# EasyEDA Pro project FrameworkGPU to MXM V0.3.epro, board PCB6
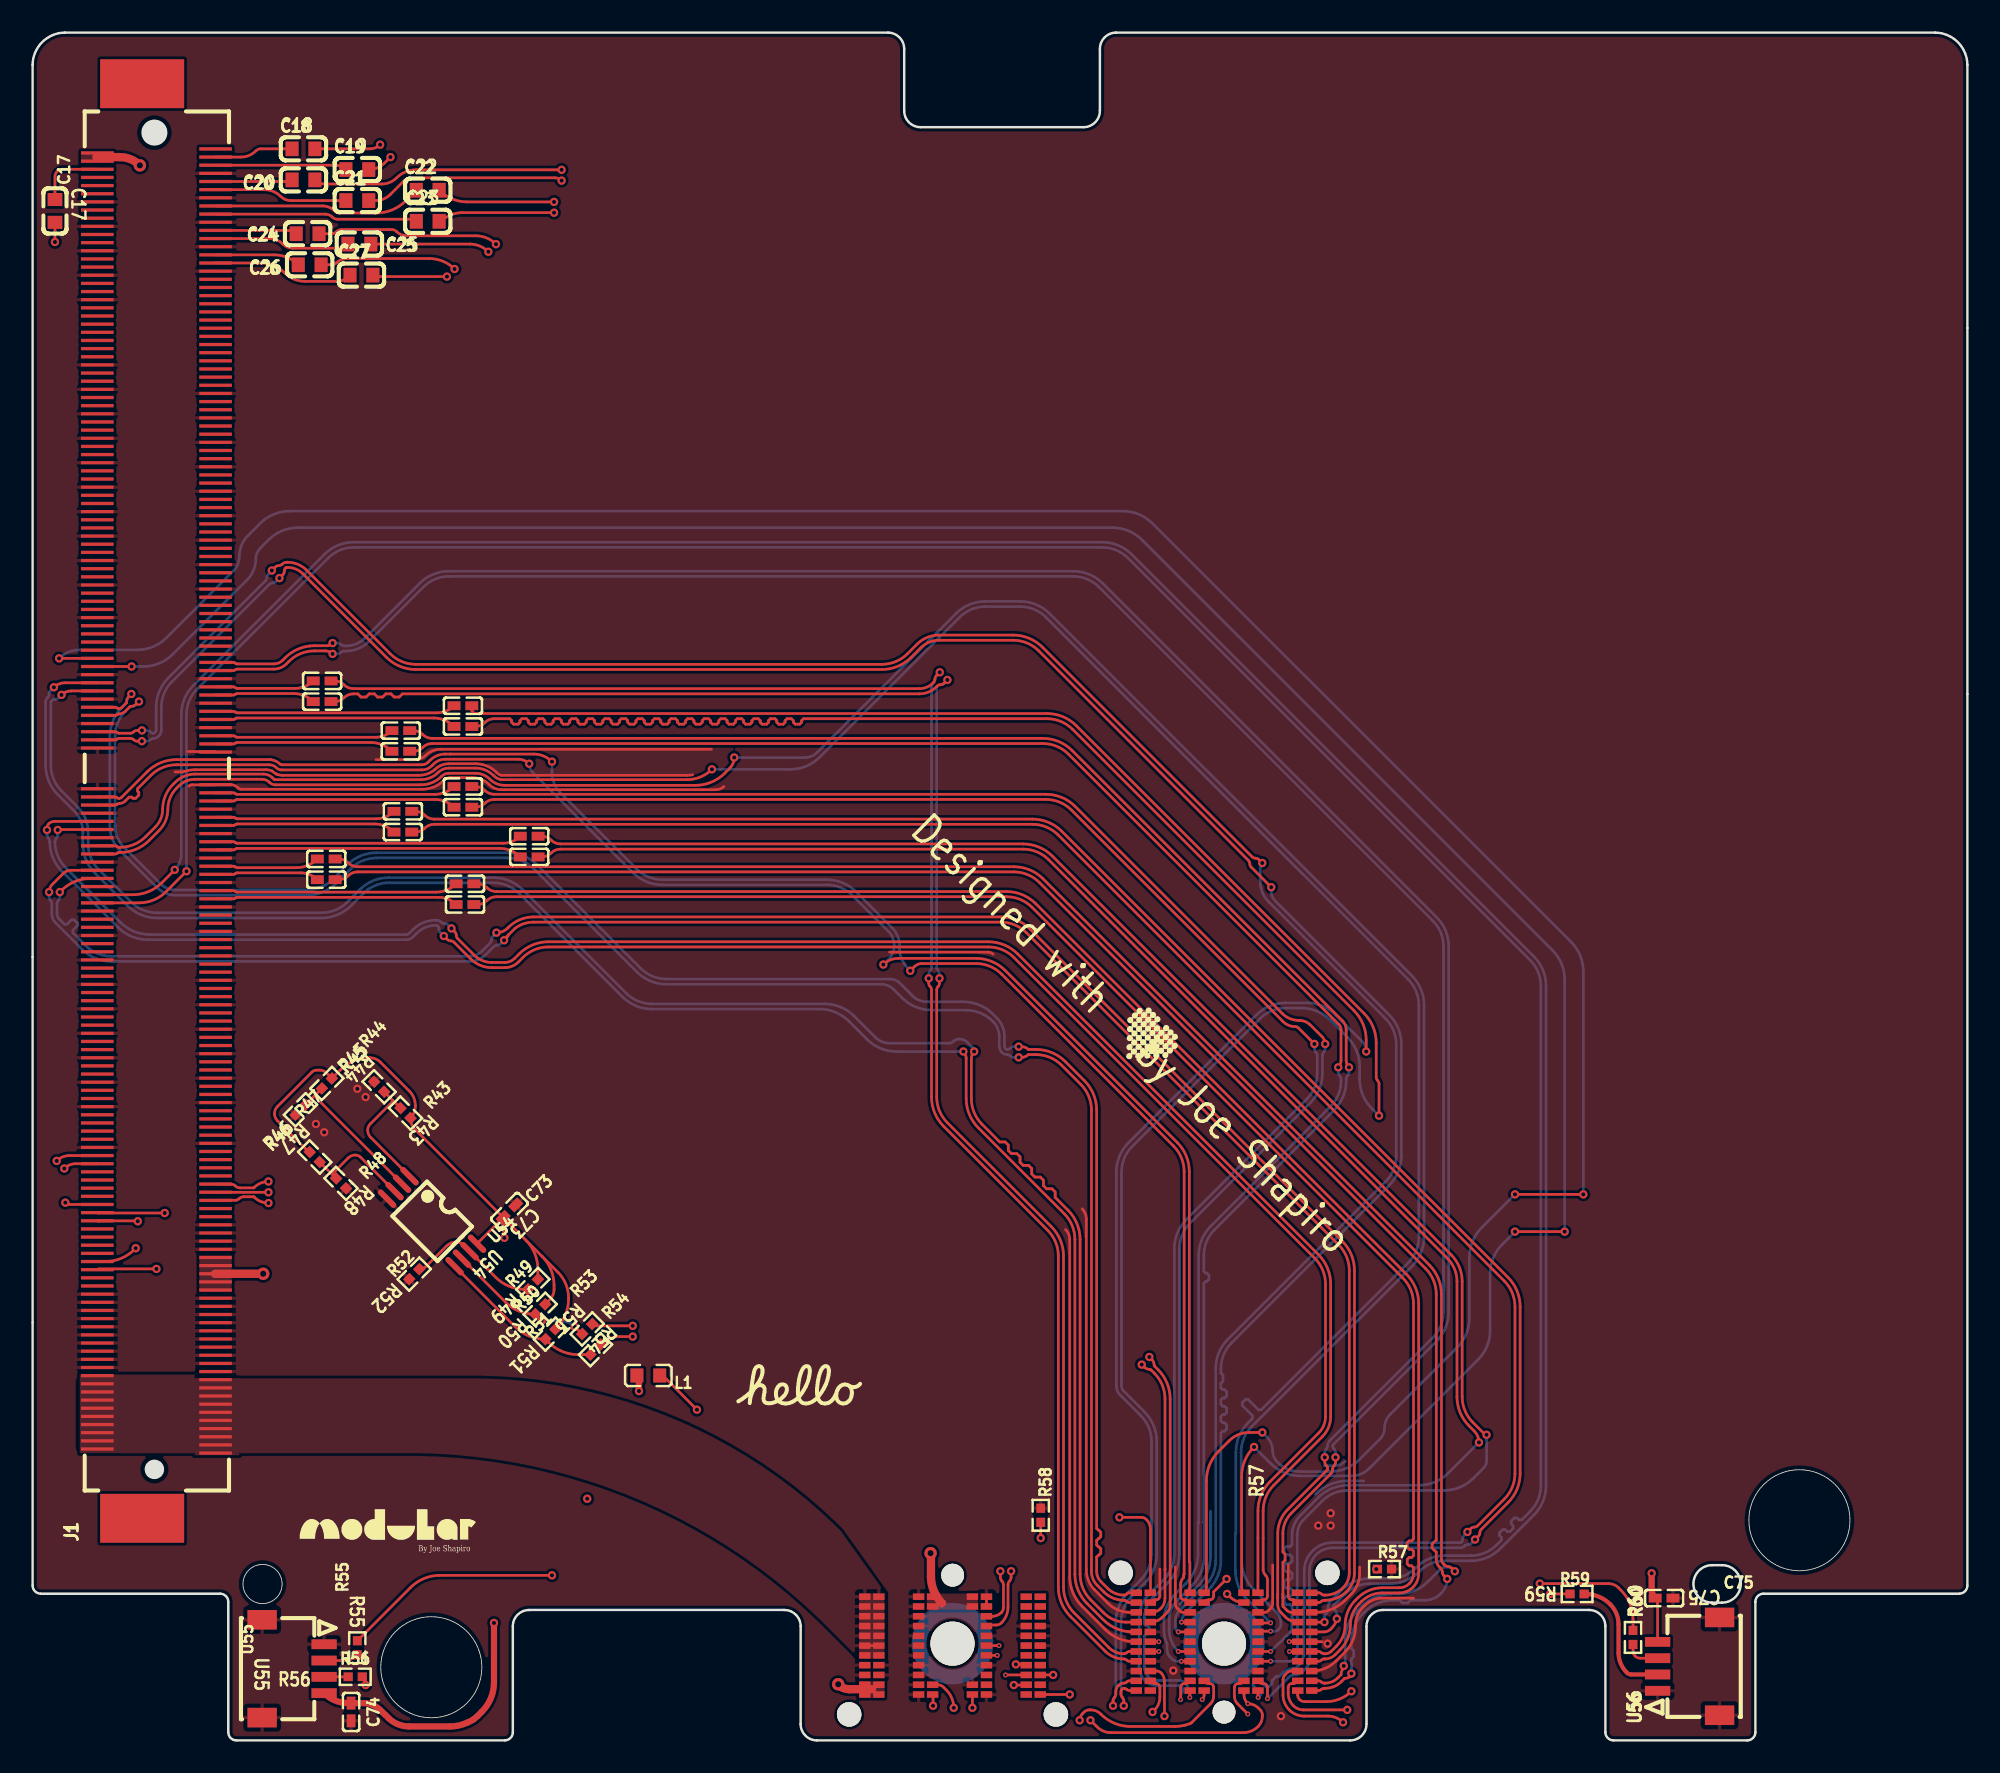
[diagram p5: board, top side]
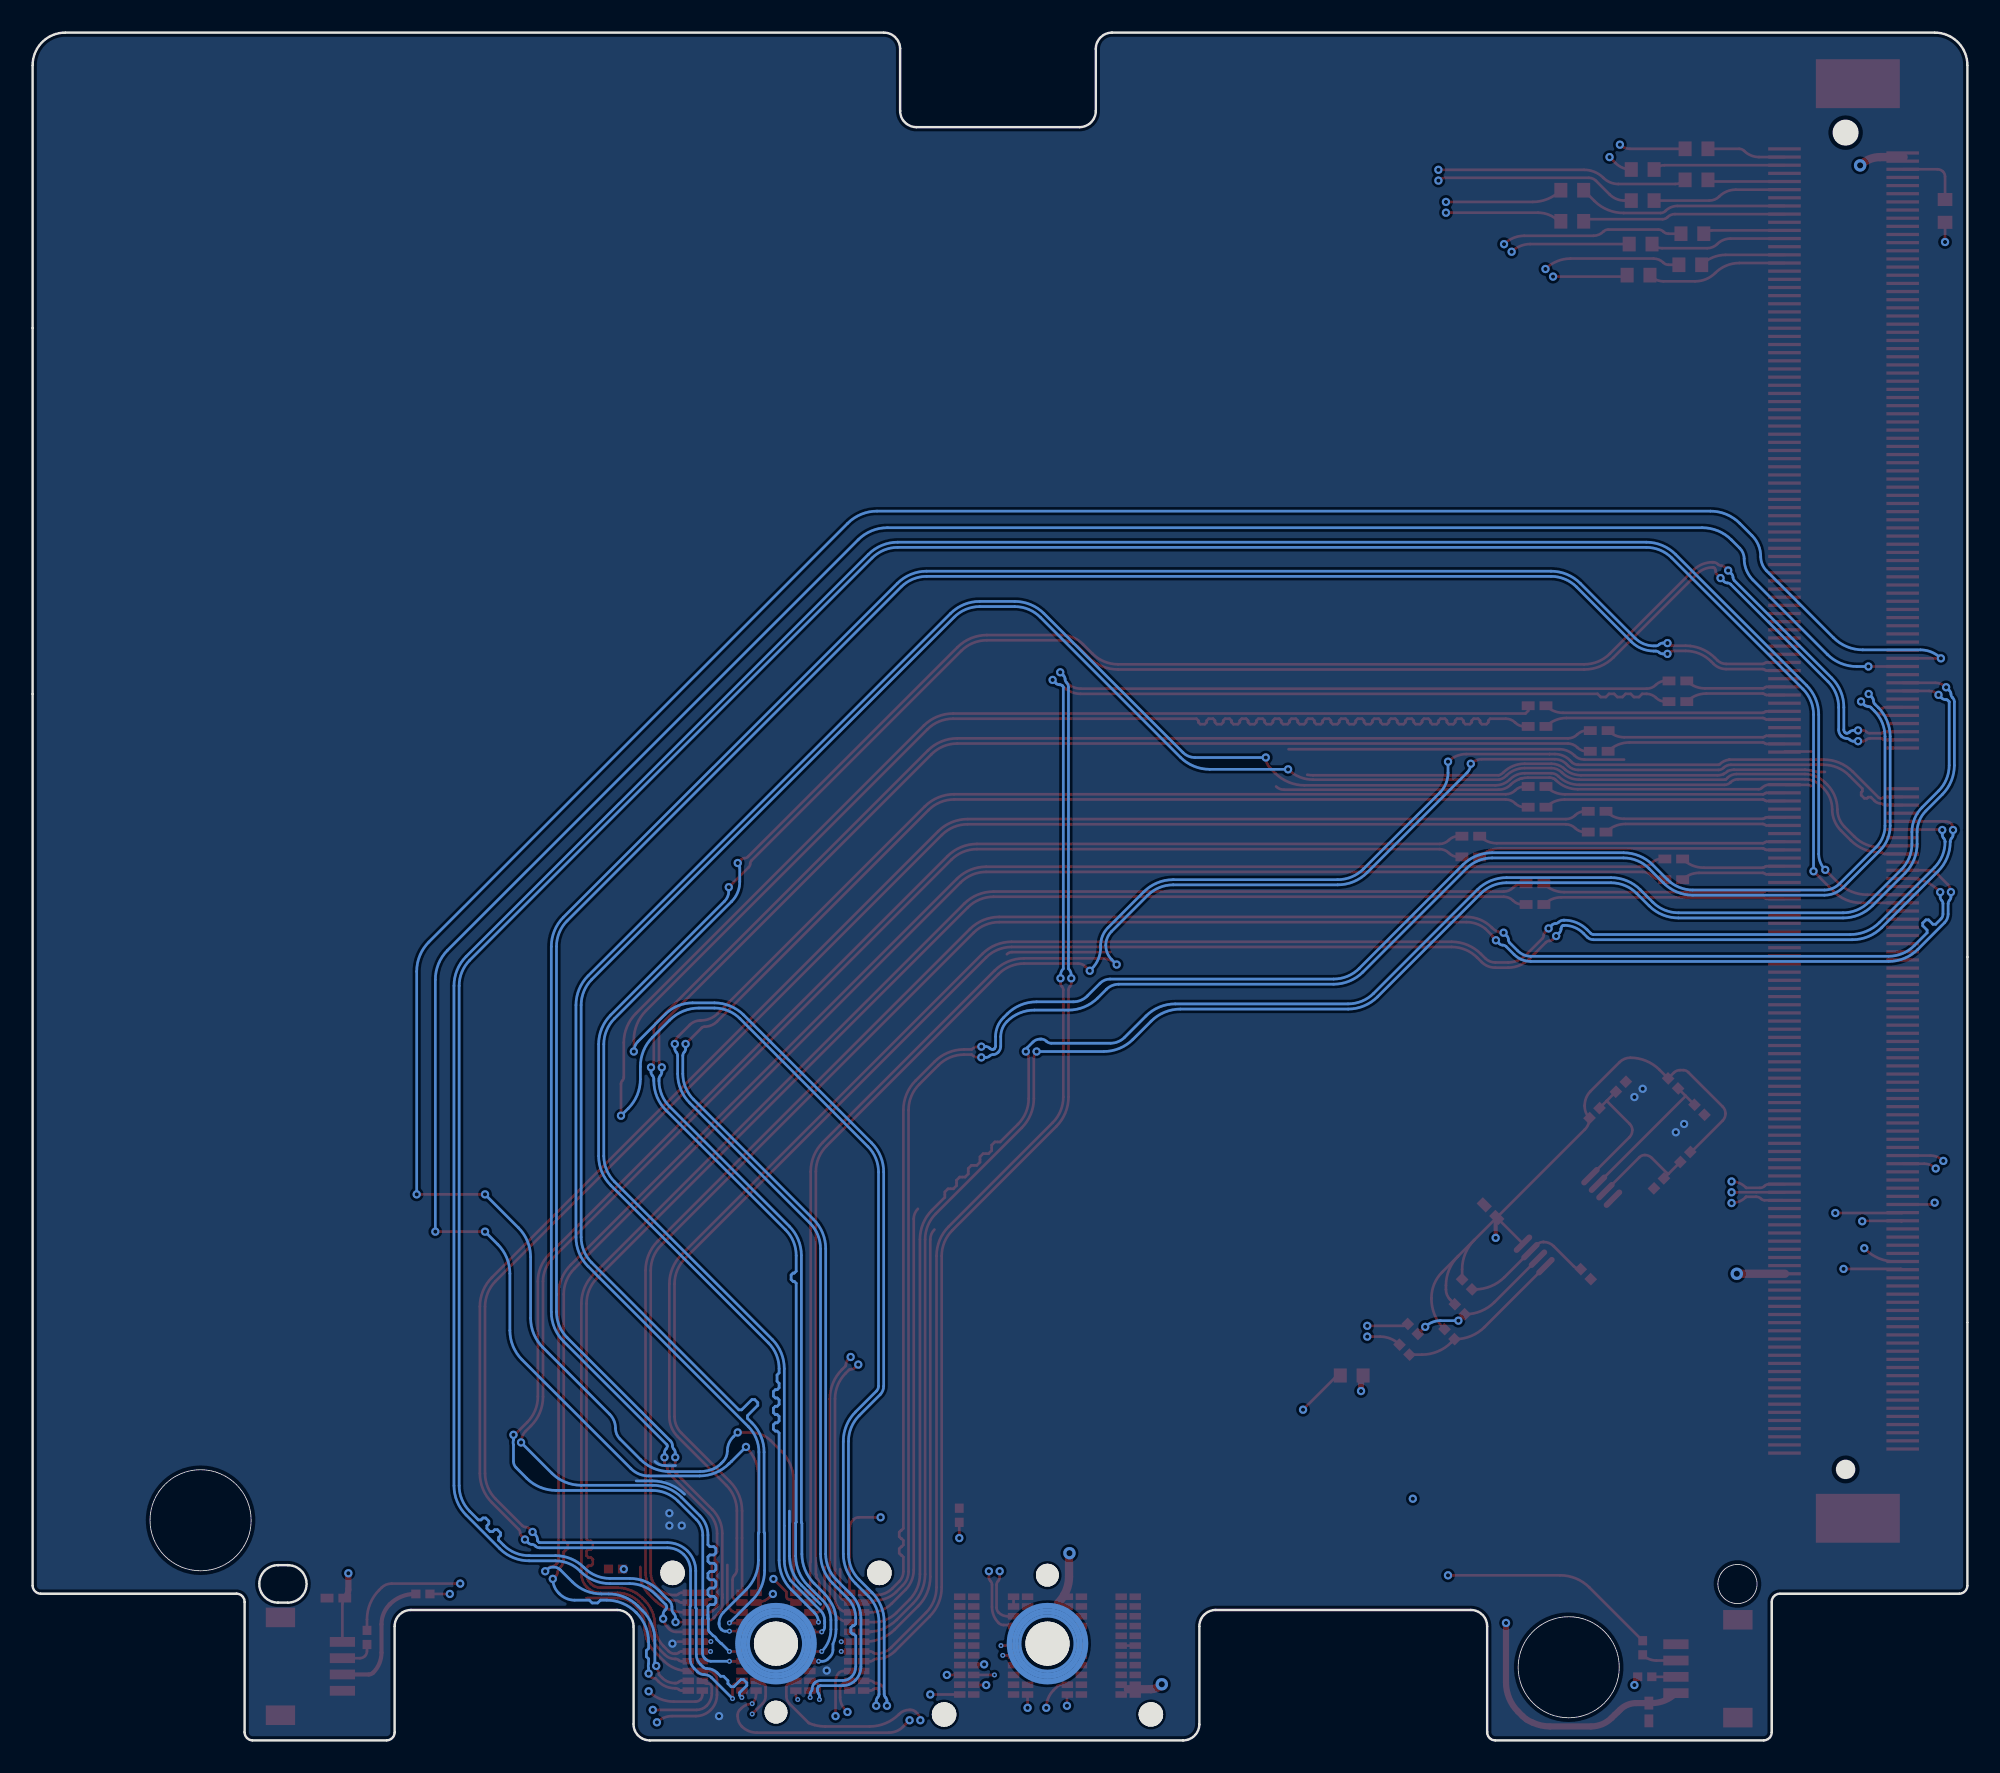
[diagram p6: board, bottom side, seen from below]

Outline 118.65 x 104.76 mm; copper layers: Top Layer, Inner2, Inner3, Bottom Layer. Coordinates in mm from the lower left corner of the outline.
Outline path: circle c14.1,9.59 r1.2 ; circle c24.45,4.49 r3.1 ; circle c108.35,13.5 r3.1 ; 0,102.76 arc(0.59,104.17) 2,104.76 52.45,104.76 arc(53.16,104.47) 53.45,103.76 53.45,99.96 arc(53.74,99.25) 54.45,98.96 64.45,98.96 arc(65.16,99.25) 65.45,99.96 65.45,103.76 arc(65.74,104.47) 66.45,104.76 116.65,104.76 arc(118.06,104.17) 118.65,102.76 118.65,9.5 arc(118.5,9.15) 118.15,9 106.15,9 arc(105.8,8.85) 105.65,8.5 105.65,0.5 arc(105.5,0.15) 105.15,0 96.95,0 arc(96.6,0.15) 96.45,0.5 96.45,7 arc(96.16,7.71) 95.45,8 82.8,8 arc(82.09,7.71) 81.8,7 81.8,1 arc(81.51,0.29) 80.8,0 48.1,0 arc(47.39,0.29) 47.1,1 47.1,7 arc(46.81,7.71) 46.1,8 30.45,8 arc(29.74,7.71) 29.45,7 29.45,0.5 arc(29.3,0.15) 28.95,0 12.5,0 arc(12.15,0.15) 12,0.5 12,8.5 arc(11.85,8.85) 11.5,9 0.5,9 arc(0.15,9.15) 0,9.5 0,102.76 ; 103,8.45 arc(101.85,9.6) 103,10.75 103.6,10.75 arc(104.75,9.6) 103.6,8.45 103,8.45
Stack: Top Layer 0.035mm / Dielectric1 1.51mm FR4 er 4.5 / Inner2 0.035mm / Dielectric2 0.48mm PP er 4.5 / Inner3 0.035mm / Dielectric3 0.48mm PP er 4.5 / Bottom Layer 0.035mm

## Design rules (mm)
net PCIE_RX_7N: PCIE_RX_7
net PCIE_RX_1P: PCIE_RX_1, PCIE_RX_1
net PCIE_RX_1N: PCIE_RX_1, PCIE_RX_1
net PCIE_RX_7P: PCIE_RX_7
net PCIE_RX_6N: DP1
net PCIE_RX_3N: PCIE_RX_3
net PCIE_RX_0N: PCIE_RX_0
net PCIE_RX_0P: PCIE_RX_0
net PCIE_RX_4N: PCIE_RX_4
net PCIE_RX_6P: DP1
net PCIE_RX_5N: PCIE_RX_5
net PCIE_RX_5P: PCIE_RX_5
net PCIE_RX_2P: PCIE_RX_2
net PCIE_RX_4P: PCIE_RX_4
net PCIE_RX_3P: PCIE_RX_3
net PCIE_RX_2N: PCIE_RX_2
net $1N3802: DP9
net $1N3808: DP9
net $1N4102: DP5
net $1N3928: DP8
net $1N4162: DP3
net $1N4168: DP3
net $1N4222: DP4
net PEX_REFCLK-: DP11
net DP_A_AUXN: DP_A_AUX
net $1N3868: PCIE_TX_1, DP10
net $1N3862: PCIE_TX_1, DP10
net $1N4228: DP4
net PEX_REFCLK+: DP11
net DP_A_AUXP: DP_A_AUX
net $1N3988: DP7
net DP_A_L0N: DP_A_L0
net $1N3982: DP7
net $1N3922: DP8
net DP_A_L1N: DP_A_L1
net DP_A_L3N: DP_A_L3
net DP_A_L0P: DP_A_L0
net DP_A_L2N: DP_A_L2
net DP_A_L2P: DP_A_L2
net DP_A_L1P: DP_A_L1
net DP_A_L3P: DP_A_L3
net $1N4108: DP5
net $1N4042: DP6
net $1N4048: DP6
net $1N13436: DP13
net $1N13662: DP15
net $1N13602: DP14
net $1N13548: DP13
net $1N13722: DP15
net $1N13668: DP14
net $1N13542: DP12
net $1N13608: DP12
net PCIE_TX_7P: DP2
net PCIE_TX_6P: PCIE_TX_6
net PCIE_TX_7N: DP2
net PCIE_TX_6N: PCIE_TX_6
net PCIE_TX_4P: PCIE_TX_4
net PCIE_TX_4N: PCIE_TX_4
net PCIE_TX_3P: PCIE_TX_3
net PCIE_TX_5N: PCIE_TX_5
net PCIE_TX_2N: PCIE_TX_2
net PCIE_TX_0P: PCIE_TX_0
net PCIE_TX_5P: PCIE_TX_5
net PCIE_TX_2P: PCIE_TX_2
net PCIE_TX_0N: PCIE_TX_0
net PCIE_TX_1N: PCIE_TX_1, PCIE_TX_1
net PCIE_TX_1P: PCIE_TX_1, PCIE_TX_1
net PCIE_TX_3N: PCIE_TX_3
template: Custom Config
spacing copperThickness1oz (default): track to track 0.102, other pairs 0.152 to 0.3
spacing copperThickness2oz: track to track 0.203, other pairs 0.152 to 0.3
track width copperThickness1oz (default): min 0.127, default 0.165, max 2.54
track width copperThickness2oz: min 0.203, default 0.254, max 2.54
differential pair differentialPair (default): width min 0.127, default 0.165, max 2.54; gap min 0.152, default 0.152
via viaSize (default): diameter min 0.251, default 0.508, max 10; hole min 0.15, default 0.254, max 6.3

## Placement (name value [footprint] x y rotation side)
C1  220nF  [C0402]  17.75 64.99 0 top
C2  220nF  [C0402]  17.75 63.72 0 top
C3  220nF  [C0402]  26.39 63.47 0 top
C4  220nF  [C0402]  26.39 62.2 0 top
C5  220nF  [C0402]  22.58 61.94 0 top
C6  220nF  [C0402]  22.58 60.67 0 top
C7  220nF  [C0402]  26.39 58.51 0 top
C8  220nF  [C0402]  26.39 57.24 0 top
C9  220nF  [C0402]  22.71 56.99 0 top
C10  220nF  [C0402]  22.71 55.72 0 top
C11  220nF  [C0402]  30.45 55.47 0 top
C12  220nF  [C0402]  30.45 54.2 0 top
C13  220nF  [C0402]  18.01 54.07 0 top
C14  220nF  [C0402]  18.01 52.8 0 top
C15  220nF  [C0402]  26.52 52.54 0 top
C16  220nF  [C0402]  26.52 51.27 0 top
C17  100nF  [C0603]  1.37 93.82 270 top
C18  100nF  [C0603]  16.61 97.63 0 top
C19  100nF  [C0603]  19.91 96.36 0 top
C20  100nF  [C0603]  16.61 95.72 0 top
C21  100nF  [C0603]  19.91 94.45 0 top
C22  100nF  [C0603]  24.23 95.09 0 top
C23  100nF  [C0603]  24.23 93.18 0 top
C24  100nF  [C0603]  16.86 92.42 0 top
C25  100nF  [C0603]  20.04 91.79 0 top
C26  100nF  [C0603]  16.99 90.52 0 top
C27  100nF  [C0603]  20.17 89.88 0 top
C73  0.1uF  [C0402#2]  29.24 32.46 225 top
C74  10uF  [C0402#2]  19.53 1.74 270 top
C75  10uF  [C0402#2]  100.05 8.73 0 top
J1  MXM3.0  [CONN-SMD_314P-P0.50_10151114-001TLF]  7.59 57.62 90 top
L1  100M  [L0603]  37.76 22.38 180 top
R43  0/NC  [R0402]  22.87 38.48 315 top
R44  0  [R0402]  21.25 40.1 315 top
R45  0/NC  [R0402]  18.05 40.3 45 top
R46  0  [R0402]  16.43 38.68 45 top
R47  0/NC  [R0402]  17.3 35.79 135 top
R48  0  [R0402]  18.91 34.17 135 top
R49  100K ±1%  [R0402]  30.68 27.97 45 top
R50  4.7K ±1%  [R0402]  31.13 26.45 45 top
R51  4.7K ±1%  [R0402]  31.76 24.92 45 top
R52  100K ±1%  [R0402]  23.41 28.6 45 top
R53  0  [R0402]  34.01 25.24 225 top
R54  0  [R0402]  34.52 23.97 225 top
R55  0  [R0402]  19.91 5.68 90 top
R56  0  [R0402]  19.79 3.9 0 top
R57  330k ±1%  [R0402]  82.9 10.51 180 top
R58  330k ±1%  [R0402]  61.82 13.81 270 top
R59  0  [R0402]  94.72 8.98 180 top
R60  0  [R0402]  98.14 6.32 90 top
U2  FXBeam  [FW_FXBEAM_FULL]  64.74 5.94 0 top
U54  BR24G32FVT-3GE2  [TSSOP-8_L4.4-W3.0-P0.65-LS6.4-BL]  24.49 31.85 225 top
U55  A1001WR-S-04P  [CONN-SMD_A1001WR-S-04P]  15.98 4.4 270 top
U56  A1001WR-S-04P  [CONN-SMD_A1001WR-S-04P]  101.55 4.54 90 top

## Footprints (pads in the part's own frame, mm; a bottom-side part is the same pattern mirrored in y, then rotated)
C0402
  rect 0.79x0.54 smd: 1(-0.545,0) 2(0.545,0)
C0402#2
  rect 0.79x0.54 smd: 1(0.545,0) 2(-0.545,0)
C0603
  rect 0.8x0.9 smd: 1(-0.7,0) 2(0.7,0)
CONN-SMD_314P-P0.50_10151114-001TLF
  rect 0.2x2 smd: 1(-30,-3.625) 2(-29.75,3.625) 3(-29.5,-3.625) 4(-29.25,3.625) 5(-29,-3.625) 6(-28.75,3.625) 7(-28.5,-3.625) 8(-28.25,3.625) 9(-28,-3.625) 10(-27.75,3.625) 11(-27.5,-3.625) 12(-27.25,3.625) 13(-27,-3.625) 14(-26.75,3.625) 15(-26.5,-3.625) 16(-26.25,3.625) 17(-26,-3.625) 18(-25.75,3.625) 19(-25.5,-3.625) 20(-25.25,3.625) 21(-25,-3.625) 22(-24.75,3.625) 23(-24.5,-3.625) 24(-24.25,3.625) 25(-24,-3.625) 26(-23.75,3.625) 27(-23.5,-3.625) 28(-23.25,3.625) 29(-23,-3.625) 30(-22.75,3.625) 31(-22.5,-3.625) 32(-22.25,3.625) 33(-22,-3.625) 34(-21.75,3.625) 35(-21.5,-3.625) 36(-21.25,3.625) 37(-21,-3.625) 38(-20.75,3.625) 39(-20.5,-3.625) 40(-20.25,3.625) 41(-20,-3.625) 42(-19.75,3.625) 43(-19.5,-3.625) 44(-19.25,3.625) 45(-19,-3.625) 46(-18.75,3.625) 47(-18.5,-3.625) 48(-18.25,3.625) 49(-18,-3.625) 50(-17.75,3.625) 51(-17.5,-3.625) 52(-17.25,3.625) 53(-17,-3.625) 54(-16.75,3.625) 55(-16.5,-3.625) 56(-16.25,3.625) 57(-16,-3.625) 58(-15.75,3.625) 59(-15.5,-3.625) 60(-15.25,3.625) 61(-15,-3.625) 62(-14.75,3.625) 63(-14.5,-3.625) 64(-14.25,3.625) 65(-14,-3.625) 66(-13.75,3.625) 67(-13.5,-3.625) 68(-13.25,3.625) 69(-13,-3.625) 70(-12.75,3.625) 71(-12.5,-3.625) 72(-12.25,3.625) 73(-12,-3.625) 74(-11.75,3.625) 75(-11.5,-3.625) 76(-11.25,3.625) 77(-11,-3.625) 78(-10.75,3.625) 79(-10.5,-3.625) 80(-10.25,3.625) 81(-10,-3.625) 82(-9.75,3.625) 83(-9.5,-3.625) 84(-9.25,3.625) 85(-9,-3.625) 86(-8.75,3.625) 87(-8.5,-3.625) 88(-8.25,3.625) 89(-8,-3.625) 90(-7.75,3.625) 91(-7.5,-3.625) 92(-7.25,3.625) 93(-7,-3.625) 94(-6.75,3.625) 95(-6.5,-3.625) 96(-6.25,3.625) 97(-6,-3.625) 98(-5.75,3.625) 99(-5.5,-3.625) 100(-5.25,3.625) 101(-5,-3.625) 102(-4.75,3.625) 103(-4.5,-3.625) 104(-4.25,3.625) 105(-4,-3.625) 106(-3.75,3.625) 107(-3.5,-3.625) 108(-3.25,3.625) 109(-3,-3.625) 110(-2.75,3.625) 111(-2.5,-3.625) 112(-2.25,3.625) 113(-2,-3.625) 114(-1.75,3.625) 115(-1.5,-3.625) 116(-1.25,3.625) 117(-1,-3.625) 118(-0.75,3.625) 119(-0.5,-3.625) 120(-0.25,3.625) 121(-0.001,-3.625) 122(0.25,3.625) 123(0.5,-3.625) 124(0.75,3.625) 125(1,-3.625) 133(3,-3.625) 134(3.249,3.625) 135(3.5,-3.625) 136(3.75,3.625) 137(4,-3.625) 138(4.25,3.625) 139(4.5,-3.625) 140(4.75,3.625) 141(5,-3.625) 142(5.25,3.625) 143(5.5,-3.625) 144(5.75,3.625) 145(6,-3.625) 146(6.25,3.625) 147(6.5,-3.625) 148(6.75,3.625) 149(7,-3.625) 150(7.25,3.625) 151(7.5,-3.625) 152(7.75,3.625) 153(8,-3.625) 154(8.25,3.625) 155(8.5,-3.625) 156(8.75,3.625) 157(9,-3.625) 158(9.25,3.625) 159(9.5,-3.625) 160(9.75,3.625) 161(10,-3.625) 162(10.25,3.625) 163(10.5,-3.625) 164(10.75,3.625) 165(11,-3.625) 166(11.25,3.625) 167(11.5,-3.625) 168(11.75,3.625) 169(12,-3.625) 170(12.25,3.625) 171(12.5,-3.625) 172(12.75,3.625) 173(13,-3.625) 174(13.25,3.625) 175(13.5,-3.625) 176(13.75,3.625) 177(14,-3.625) 178(14.25,3.625) 179(14.5,-3.625) 180(14.75,3.625) 181(15,-3.625) 182(15.25,3.625) 183(15.5,-3.625) 184(15.75,3.625) 185(16,-3.625) 186(16.25,3.625) 187(16.5,-3.625) 188(16.75,3.625) 189(17,-3.625) 190(17.25,3.625) 191(17.5,-3.625) 192(17.75,3.625) 193(18,-3.625) 194(18.25,3.625) 195(18.5,-3.625) 196(18.75,3.625) 197(19,-3.625) 198(19.25,3.625) 199(19.5,-3.625) 200(19.75,3.625) 201(20,-3.625) 202(20.25,3.625) 203(20.5,-3.625) 204(20.75,3.625) 205(21,-3.625) 206(21.25,3.625) 207(21.5,-3.625) 208(21.75,3.625) 209(22,-3.625) 210(22.25,3.625) 211(22.5,-3.625) 212(22.75,3.625) 213(23,-3.625) 214(23.25,3.625) 215(23.5,-3.625) 216(23.75,3.625) 217(24,-3.625) 218(24.25,3.625) 219(24.5,-3.625) 220(24.75,3.625) 221(25,-3.625) 222(25.25,3.625) 223(25.5,-3.625) 224(25.75,3.625) 225(26,-3.625) 226(26.25,3.625) 227(26.5,-3.625) 228(26.75,3.625) 229(27,-3.625) 230(27.25,3.625) 231(27.5,-3.625) 232(27.75,3.625) 233(28,-3.625) 234(28.25,3.625) 235(28.5,-3.625) 236(28.75,3.625) 237(29,-3.625) 238(29.25,3.625) 239(29.5,-3.625) 240(29.75,3.625) 241(30,-3.625) 242(30.25,3.625) 243(30.5,-3.625) 244(30.75,3.625) 245(31,-3.625) 246(31.25,3.625) 247(31.5,-3.625) 248(31.75,3.625) 249(32,-3.625) 250(32.25,3.625) 251(32.5,-3.625) 252(32.75,3.625) 253(33,-3.625) 254(33.25,3.625) 255(33.5,-3.625) 256(33.75,3.625) 257(34,-3.625) 258(34.25,3.625) 259(34.5,-3.625) 260(34.75,3.625) 261(35,-3.625) 262(35.25,3.625) 263(35.5,-3.625) 264(35.75,3.625) 265(36,-3.625) 266(36.25,3.625) 267(36.5,-3.625) 268(36.75,3.625) 269(37,-3.625) 270(37.25,3.625) 271(37.5,-3.625) 272(37.75,3.625) 273(38,-3.625) 274(38.25,3.625) 275(38.5,-3.625) 276(38.75,3.625) 277(39,-3.625) 278(39.25,3.625) 279(39.5,-3.625) 280(39.75,3.625) 281(40,-3.625) E1(-40,-3.625) E1(-39.5,-3.625) E1(-39,-3.625) E1(-38.5,-3.625) E1(-38,-3.625) E1(-37.5,-3.625) E1(-37,-3.625) E1(-36.5,-3.625) E1(-36,-3.625) E1(-35.5,-3.625) E2(-39.75,3.625) E2(-39.25,3.625) E2(-38.75,3.625) E2(-38.25,3.625) E2(-37.75,3.625) E2(-37.25,3.625) E2(-36.75,3.625) E2(-36.25,3.625) E2(-35.75,3.625) E2(-35.25,3.625) E3(-35,-3.625) E3(-34.5,-3.625) E3(-34,-3.625) E3(-33.5,-3.625) E3(-33,-3.625) E3(-32.5,-3.625) E3(-32,-3.625) E3(-31.5,-3.625) E3(-31,-3.625) E3(-30.5,-3.625) E4(-34.75,3.625) E4(-34.25,3.625) E4(-33.75,3.625) E4(-33.25,3.625) E4(-32.75,3.625) E4(-32.25,3.625) E4(-31.75,3.625) E4(-31.25,3.625) E4(-30.75,3.625) E4(-30.25,3.625)
  rect 3x5.15 smd: 282(44,0.875) 283(-44,0.875)
CONN-SMD_A1001WR-S-04P
  rect 0.6x1.55 smd: 1(-1.5,1.9) 2(-0.5,1.9) 3(0.5,1.9) 4(1.5,1.9)
  rect 1.2x1.8 smd: 5(3,-1.9) 6(-3,-1.9)
FW_FXBEAM_FULL
  round 1.5 hole 1.5: (-14.67,-4.34) (-1.99,-4.345) (1.98,4.34) (14.66,4.34)
  round 2.7 hole 2.7: (-8.33,0) (8.32,0)
  round 1.4 hole 1.4: (-8.325,4.2) (8.32,-4.2)
  rect 0.7x0.4 smd: PA1(-2.95,2.88) PA2(-3.81,2.88) PA3(-6.25,2.88) PA4(-7.11,2.88) PA5(-9.55,2.88) PA6(-10.41,2.88) PA7(-12.85,2.88) PA8(-13.71,2.88) PB1(-2.95,2.28) PB2(-3.81,2.28) PB3(-6.25,2.28) PB4(-7.11,2.28) PB5(-9.55,2.28) PB6(-10.41,2.28) PB7(-12.85,2.28) PB8(-13.71,2.28) PC1(-2.95,1.68) PC2(-3.81,1.68) PC3(-6.25,1.68) PC6(-10.41,1.68) PC7(-12.85,1.68) PC8(-13.71,1.68) PD1(-2.95,1.08) PD2(-3.81,1.08) PD3(-6.25,1.08) PD6(-10.41,1.08) PD7(-12.85,1.08) PD8(-13.71,1.08) PE1(-2.95,0.48) PE2(-3.81,0.48) PE3(-6.25,0.48) PE6(-10.41,0.48) PE7(-12.85,0.48) PE8(-13.71,0.48) PF1(-2.95,-0.12) PF2(-3.81,-0.12) PF3(-6.25,-0.12) PF6(-10.41,-0.12) PF7(-12.85,-0.12) PF8(-13.71,-0.12) PG1(-2.95,-0.72) PG2(-3.81,-0.72) PG3(-6.25,-0.72) PG6(-10.41,-0.72) PG7(-12.85,-0.72) PG8(-13.71,-0.72) PH1(-2.95,-1.32) PH2(-3.81,-1.32) PH3(-6.25,-1.32) PH6(-10.41,-1.32) PH7(-12.85,-1.32) PH8(-13.71,-1.32) PJ1(-2.95,-1.92) PJ2(-3.81,-1.92) PJ3(-6.25,-1.92) PJ6(-10.41,-1.92) PJ7(-12.85,-1.92) PJ8(-13.71,-1.92) PK1(-2.95,-2.52) PK2(-3.81,-2.52) PK3(-6.25,-2.52) PK4(-7.11,-2.52) PK5(-9.55,-2.52) PK6(-10.41,-2.52) PK7(-12.85,-2.52) PK8(-13.71,-2.52) PL1(-2.95,-3.12) PL2(-3.81,-3.12) PL3(-6.25,-3.12) PL4(-7.11,-3.12) PL5(-9.55,-3.12) PL6(-10.41,-3.12) PL7(-12.85,-3.12) PL8(-13.71,-3.12) SA1(13.7,3.12) SA2(12.84,3.12) SA3(10.4,3.12) SA4(9.54,3.12) SA5(7.1,3.12) SA6(6.24,3.12) SA7(3.8,3.12) SA8(2.94,3.12) SB1(13.7,2.52) SB2(12.84,2.52) SB3(10.4,2.52) SB4(9.54,2.52) SB5(7.1,2.52) SB6(6.24,2.52) SB7(3.8,2.52) SB8(2.94,2.52) SC1(13.7,1.92) SC2(12.84,1.92) SC3(10.4,1.92) SC6(6.24,1.92) SC7(3.8,1.92) SC8(2.94,1.92) SD1(13.7,1.32) SD2(12.84,1.32) SD3(10.4,1.32) SD6(6.24,1.32) SD7(3.8,1.32) SD8(2.94,1.32) SE1(13.7,0.72) SE2(12.84,0.72) SE3(10.4,0.72) SE6(6.24,0.72) SE7(3.8,0.72) SE8(2.94,0.72) SF1(13.7,0.12) SF2(12.84,0.12) SF3(10.4,0.12) SF6(6.24,0.12) SF7(3.8,0.12) SF8(2.94,0.12) SG1(13.7,-0.48) SG2(12.84,-0.48) SG3(10.4,-0.48) SG6(6.24,-0.48) SG7(3.8,-0.48) SG8(2.94,-0.48) SH1(13.7,-1.08) SH2(12.84,-1.08) SH3(10.4,-1.08) SH6(6.24,-1.08) SH7(3.8,-1.08) SH8(2.94,-1.08) SJ1(13.7,-1.68) SJ2(12.84,-1.68) SJ3(10.4,-1.68) SJ6(6.24,-1.68) SJ7(3.8,-1.68) SJ8(2.94,-1.68) SK1(13.7,-2.28) SK2(12.84,-2.28) SK3(10.4,-2.28) SK4(9.54,-2.28) SK5(7.1,-2.28) SK6(6.24,-2.28) SK7(3.8,-2.28) SK8(2.94,-2.28) SL1(13.7,-2.88) SL2(12.84,-2.88) SL3(10.4,-2.88) SL4(9.54,-2.88) SL5(7.1,-2.88) SL6(6.24,-2.88) SL7(3.8,-2.88) SL8(2.94,-2.88)
L0603
  rect 0.8x0.864 smd: 1(-0.7,0) 2(0.7,0)
R0402
  rect 0.566x0.54 smd: 1(-0.433,0) 2(0.433,0)
TSSOP-8_L4.4-W3.0-P0.65-LS6.4-BL
  oval 0.353x1.454 smd: 1(-0.975,-2.927) 2(-0.325,-2.927) 3(0.325,-2.927) 4(0.975,-2.927) 5(0.975,2.927) 6(0.325,2.927) 7(-0.325,2.927) 8(-0.975,2.927)

## Nets
As in the schematic.

Pads without a net: J1 2 4 10 12 14 16 19 21 26 28 29 30 31 33 35 38 39 40 41 42 43 44 45 48 49 50 51 54 55 56 57 60 61 62 63 66 67 68 69 72 73 74 75 78 79 80 81 84 85 86 87 90 91 92 93 158 159 160 161 162 163 164 165 167 168 169 170 171 172 175 176 177 178 181 182 183 184 187 188 189 190 193 194 195 196 199 200 201 202 205 206 207 208 211 212 213 214 217 218 219 220 223 224 225 226 227 229 230 231 232 233 234 235 236 237 238 239 240 241 242 243 245 246 247 248 249 252 254 258 260 264 266 270 272 274 281 282 283; U2 PA1 PA2 PB1 PB2 PC1 PC2 PF2 PG1 PG2 PH1 PJ3 PK1 PK3 PL2 SA2 SL7

## Via types
v1: diameter 0.508, hole 0.254, Top Layer to Bottom Layer, 132 vias
v2: diameter 0.305, hole 0.152, Top Layer to Bottom Layer, 22 vias
v3: diameter 0.762, hole 0.381, Top Layer to Bottom Layer, 4 vias

## Routing (per net, layer and track width the routed paths; a pad name or vN(x,y) marks a point on that pad's centre or on a via; arc(x,y) is an arc through that point)
12V_FAN: length 105.6
  Top Layer w0.165: U56.4 99.65,8.37 arc(99.61,8.56) C75.2
  Top Layer w0.381: v1(28.29,7.21) 28.29,3.56 arc(28.1,2.59) 27.55,1.76 27.28,1.49 arc(27.16,1.38) 27.03,1.29 arc(26.86,1.18) 26.67,1.1 arc(26.15,0.92) 25.59,0.86 23.09,0.86 arc(22.4,0.99) 21.81,1.38 21.63,1.57 arc(21.54,1.65) 21.45,1.73 21.31,1.87 arc(20.85,2.18) 20.3,2.29 C74.2 ; v1(99.29,10.25) 99.29,9.25 arc(99.34,8.97) C75.2 ; v1(37.18,21.43) 37.18,22.08 arc(37.15,22.24) L1.2 ; 19.35,2.29 arc(18.55,2.45) U55.4
  Inner2 w0.381: v1(28.29,7.21) 28.29,8.06 arc(28.49,9.03) 29.04,9.85 v1(34.01,14.83)
  Inner3 w0.381: v1(99.29,10.25) 88.86,20.69 arc(88.03,21.24) 87.06,21.43 v1(37.18,21.43) 34.75,19 arc(34.2,18.17) 34.01,17.2 v1(34.01,14.83)
+3.3V: length 174.8
  Top Layer w0.165: R49.2 30.98,28.9 arc(30.79,29.87) 30.24,30.69 ; 32.06,25.23 32.12,25.29 arc(32.67,26.11) 32.87,27.08 32.87,27.14 arc(32.7,28) 32.21,28.72 31.23,29.7 ; 30.24,30.69 31.23,29.7 ; 30.24,30.69 C73.1 ; 31.23,29.7 arc(31.78,28.88) 31.98,27.91 31.98,27.65 arc(31.91,27.32) 31.73,27.05 R50.2 ; C73.1 23.46,37.47 arc(23.25,37.79) R43.2 arc(23.39,38.5) 23.47,38.89 23.47,38.96 arc(23.38,39.42) 23.11,39.82 21.33,41.61 arc(21.03,41.81) 20.67,41.88 arc(19.7,41.68) 18.88,41.13 R45.2 18,40.96 arc(17.83,41.07) 17.63,41.11 17.42,41.11 arc(17.26,41.08) 17.12,40.99 15.01,38.88 arc(14.88,38.68) 14.83,38.45 arc(14.88,38.21) 15.01,38.01 16.89,36.13 arc(16.94,36.1) 16.99,36.09 ; C73.1 arc(28.91,32) 28.93,31.9 ; C73.1 arc(28.86,32.07) 28.85,32.07 U54.8
  Top Layer w0.254: v1(28.93,30.83) 28.93,31.9
  Top Layer w0.508: 3.91,97.12 5.35,97.12 arc(6.01,96.99) v3(6.58,96.61) ; 55.09,11.49 55.09,10.06 arc(55.17,9.47) 55.39,8.92 arc(55.56,8.66) 55.77,8.41
  Inner3 w0.508: v3(6.58,96.61) 6.58,71.63 arc(6.77,70.66) 7.32,69.83 15.36,61.8 arc(15.91,60.97) 16.1,60 16.1,31.63 arc(16.3,30.65) 16.85,29.83 21.07,25.6 ; 21.07,25.6 32.63,14.05 arc(33.45,13.49) 34.43,13.3 52.23,13.3 arc(53.2,13.11) 54.02,12.56 55.09,11.49 ; 21.07,25.6 22.65,25.6 arc(23.62,25.8) 24.45,26.35 v1(28.93,30.83)
  vias: v3(55.07,11.49)
+5V: length 56.7
  Top Layer w0.508: 51.48,3.14 50.07,3.14 arc(49.71,3.21) 49.4,3.42 ; v3(14.14,28.62) 11.18,28.62
  Inner2 w0.508: v3(49.4,3.44) 49.4,7.82 arc(49.21,8.79) 48.66,9.61 39.48,18.79 arc(38.66,19.34) 37.68,19.54 19,19.54 arc(18.03,19.73) 17.2,20.28 14.88,22.6 arc(14.33,23.42) 14.14,24.39 v3(14.14,28.62)
  Bottom Layer w0.165: 49.4,3.42 v3(49.4,3.44)
GND: length 186.2
  Top Layer w0.165: U2.SB7 68.64,8.56 arc(68.72,8.6) 68.8,8.62 68.89,8.62 arc(69.06,8.69) 69.13,8.86 69.13,10.51 ; U2.SF8 67.58,6.06 arc(66.61,6.25) 65.78,6.8 64.34,8.24 arc(63.79,9.06) 63.6,10.04 63.6,30.72 arc(63.53,31.05) 63.35,31.34 ; 76.05,10.76 76.05,8.4 arc(76.01,8.24) 75.92,8.09 75.78,7.96 arc(75.67,7.88) 75.54,7.86 U2.SC3 ; 41.63,60.8 25.02,60.8 arc(24.53,60.7) 24.1,60.42 arc(23.82,60.23) 23.49,60.16 21.06,60.16 ; 81.38,10.63 81.38,10.21 arc(81.25,9.55) 80.87,8.98 80.49,8.6 arc(79.66,8.05) 78.69,7.86 U2.SC1 ; 77,10.76 77,8.86 arc(77.07,8.69) 77.23,8.62 77.33,8.62 arc(77.41,8.6) 77.48,8.56 U2.SB2 ; 11.2,60.66 9.53,60.66 ; 52.55,48.35 58.59,48.35 arc(58.76,48.32) 58.9,48.23 ; 11.17,58.62 9.77,58.62 arc(9.68,58.6) 9.6,58.54 ; 84.68,8.73 82.78,8.73 arc(82.19,8.61) 81.69,8.28 81.58,8.16 arc(81.24,7.67) 81.13,7.08 81.13,6.96 arc(80.96,6.13) 80.49,5.43 79.94,4.88 arc(79.25,4.42) U2.SJ1 ; 70.08,10.63 70.08,8.4 arc(70.11,8.24) 70.2,8.09 70.34,7.96 arc(70.45,7.88) 70.59,7.86 U2.SC6 ; U2.SC8 67.28,7.86 arc(66.57,8) 65.96,8.41 65.12,9.24 arc(64.75,9.8) 64.62,10.46 64.62,31.99 arc(64.55,32.32) 64.36,32.61 ; 8.74,59.41 9.24,59.41 arc(9.59,59.51) 9.96,59.54 14.31,59.54 arc(14.51,59.52) 14.69,59.46 arc(14.82,59.36) 14.96,59.28 ; 11.11,58.63 12.11,58.63 arc(12.37,58.58) 12.6,58.43 arc(12.7,58.37) 12.8,58.34 23.9,58.34 arc(24.62,58.49) 25.23,58.9 arc(25.25,58.92) 25.27,58.94 arc(25.33,58.98) 25.4,59.01 arc(25.51,59.05) 25.62,59.06 26.95,59.06 arc(27.13,59.05) 27.31,59.02 27.33,59.02 arc(27.41,59) 27.48,58.97 arc(27.77,58.82) 28.02,58.62 arc(28.35,58.4) 28.75,58.32 41.92,58.32 arc(42.17,58.37) 42.39,58.51 ; U2.SF1 79.09,6.06 ; U2.PB3 U2.PA3 ; 14.96,59.28 arc(14.96,59.28) 14.96,59.28 ; 14.96,59.28 arc(15.13,59.22) 15.32,59.2 23.68,59.2 arc(24.2,59.29) 24.66,59.55 arc(24.67,59.55) 24.68,59.56 arc(24.73,59.61) 24.79,59.66 arc(25.13,59.85) 25.52,59.91 27.15,59.91 arc(27.86,59.77) 28.46,59.37 arc(28.59,59.27) 28.74,59.2 40.13,59.2 arc(40.31,59.21) 40.48,59.23
  Bottom Layer w0.165: 79.22,16.86 79.88,16.86 arc(80.21,16.92) 80.49,17.11 ; 70.33,8.35 71.49,9.51 arc(72.04,10.33) 72.24,11.31 72.24,14.06 ; 81.63,15.92 80.65,15.92 arc(79.58,15.7) 78.67,15.1
  vias: v1(17.37,37.81) v1(17.88,37.3) v1(19.91,39.97) v1(20.42,39.46) v1(69.95,4.28) v1(76.55,1.49) v1(78.84,13.17) v1(79.42,5.94) v1(79.6,13.94) v1(79.6,13.17)
VCC: length 0.9
  Top Layer w0.165: U2.PF8 U2.PF7
BK_ADDR0: length 7.7
  Top Layer w0.165: R44.2 22.12,39.23 ; 22.12,39.23 R43.1 ; 22.12,39.23 20.71,37.82 arc(20.59,37.64) 20.55,37.43 arc(20.59,37.19) 20.73,36.99 U54.1
BK_ADDR1: length 9
  Top Layer w0.165: 17.28,39.54 R45.1 ; 17.28,39.54 16.73,38.99 ; 17.28,39.54 arc(17.29,39.52) 17.3,39.5 22.65,34.15
BK_ADDR2: length 6.6
  Top Layer w0.165: U54.3 20.11,35.77 arc(19.96,35.87) 19.79,35.91 arc(19.55,35.86) 19.35,35.73 18.43,34.81 arc(18.38,34.77) 18.32,34.76 ; 18.32,34.76 18.61,34.48 ; 18.32,34.76 R47.1
BK_I2C_SCL: length 37.6
  Top Layer w0.165: U2.PC3 58.87,7.62 arc(59.16,7.67) 59.41,7.84 arc(59.5,7.98) 59.54,8.15 59.54,9.55 arc(59.51,9.67) 59.44,9.78 arc(59.37,9.88) 59.35,10.01 v1(59.35,10.38) ; v1(36.8,25.43) 34.59,25.43 arc(34.44,25.46) 34.32,25.55
  Inner2 w0.165: v1(59.35,10.38) 59.35,10.08 arc(59.38,9.89) 59.49,9.73 arc(59.52,9.68) 59.54,9.62 arc(59.51,9.5) 59.45,9.4 59.28,9.24 arc(59.14,9.14) 58.98,9.11 58.77,9.11 arc(58.54,9.16) 58.34,9.29 58.27,9.36 arc(58.08,9.65) 58.01,9.98 58.01,10.73 arc(57.82,11.7) 57.27,12.52 45.29,24.5 arc(44.47,25.05) 43.5,25.24 37.64,25.24 arc(37.51,25.26) 37.41,25.33 arc(37.3,25.4) 37.18,25.43 v1(36.8,25.43)
BK_I2C_SDA: length 38.3
  Top Layer w0.165: v1(60.01,10.38) 60.01,10.01 arc(59.98,9.88) 59.91,9.78 arc(59.84,9.67) 59.82,9.55 59.82,8.19 arc(59.71,7.66) 59.41,7.21 arc(59.27,7.11) 59.1,7.08 58.65,7.08 arc(58.56,7.06) U2.PD3 ; v1(36.8,24.77) 36.02,24.77 arc(35.37,24.64) 34.82,24.28
  Inner2 w0.165: v1(36.8,24.77) 37.18,24.77 arc(37.3,24.79) 37.41,24.87 arc(37.51,24.94) 37.64,24.96 43.38,24.96 arc(44.35,24.77) 45.18,24.22 56.99,12.41 arc(57.54,11.58) 57.73,10.61 57.73,9.98 arc(57.82,9.54) 58.07,9.17 58.14,9.09 arc(58.43,8.9) 58.77,8.83 58.98,8.83 arc(59.25,8.89) 59.48,9.04 59.64,9.2 arc(59.77,9.39) 59.82,9.62 arc(59.83,9.68) 59.86,9.73 arc(59.97,9.89) 60.01,10.08 v1(60.01,10.38)
DP_A_AUXN: length 8.1
  Top Layer w0.165: J1.277 18.57,96.62 arc(18.92,96.56) C19.1
DP_A_AUXP: length 4.8
  Top Layer w0.165: J1.279 12.78,97.12 arc(13.27,97.22) 13.69,97.5 arc(13.83,97.6) 14,97.63 C18.1
DP_A_HPD: length 4.3
  Top Layer w0.165: C17.1 1.37,95.93 arc(1.4,96.09) 1.5,96.23 arc(1.65,96.34) 1.84,96.37 J1.276
DP_A_L0N: length 8.7
  Top Layer w0.165: C27.1 19.4,89.81 arc(19.05,89.58) 18.64,89.5 16.69,89.5 arc(16.03,89.63) 15.47,90.01 arc(14.79,90.46) 13.98,90.62 J1.253
DP_A_L0P: length 5.2
  Top Layer w0.165: J1.255 14.83,91.12 arc(15.62,90.97) C26.1
DP_A_L1N: length 8.3
  Top Layer w0.165: J1.259 14.53,92.12 arc(14.97,92.04) 15.34,91.79 arc(15.62,91.6) 15.95,91.53 18.73,91.53 arc(19.06,91.6) C25.1
DP_A_L1P: length 5
  Top Layer w0.165: J1.261 15.68,92.62 arc(15.94,92.57) 16.16,92.42
DP_A_L2N: length 12.6
  Top Layer w0.165: J1.265 17.94,93.62 arc(18.18,93.58) 18.39,93.44 arc(18.53,93.34) 18.69,93.31 23.35,93.31 arc(23.52,93.28) 23.66,93.18
DP_A_L2P: length 12.9
  Top Layer w0.165: J1.267 17.78,94.12 arc(18.18,94.05) 18.52,93.82 arc(18.66,93.73) 18.82,93.69 21.08,93.69 arc(22.05,93.89) 22.88,94.44 C22.1
DP_A_L3N: length 8.2
  Top Layer w0.165: J1.271 14.21,95.12 arc(14.75,95.02) 15.21,94.71 arc(15.49,94.52) 15.83,94.45 C21.1
DP_A_L3P: length 4.7
  Top Layer w0.165: J1.273 15.67,95.62 arc(15.8,95.65) C20.1
FAN1_PWM: length 46.6
  Top Layer w0.165: v1(31.85,10.13) 24.98,10.13 arc(24,9.93) 23.18,9.38 R55.2 ; U2.PK5 55.5,3.42 arc(55.69,3.38) 55.85,3.27 56.04,3.08 arc(56.37,2.59) v1(56.49,2)
  Inner2 w0.165: v1(56.49,2) 56.14,2.35 arc(55.54,2.75) 54.84,2.89 50.12,2.89 arc(49.78,2.82) 49.5,2.63 arc(49.36,2.54) 49.2,2.51 48.85,2.51 arc(48.51,2.57) 48.23,2.76 arc(48.05,3.04) 47.98,3.37 47.98,7.3 arc(47.79,8.27) 47.24,9.09 47.2,9.13 arc(46.38,9.68) 45.4,9.87 32.46,9.87 arc(32.13,9.94) v1(31.85,10.13)
FAN1_SPEED: length 59.1
  Top Layer w0.165: U2.PJ2 v2(59.66,4.02) ; v1(20.42,3.4) 20.42,3.42 arc(20.37,3.68) 20.22,3.9 ; U55.3 19.21,3.9 arc(19.22,3.9) 19.23,3.9
  Inner2 w0.165: v1(20.42,3.4) 20.42,3.12 arc(20.49,2.79) 20.67,2.51 21.71,1.47 arc(22.53,0.92) 23.5,0.73 25.46,0.73 arc(26.44,0.92) 27.26,1.47 28.19,2.4 arc(28.74,3.22) 28.93,4.19 28.93,7.21 arc(29.07,7.91) 29.47,8.51 29.71,8.75 arc(30.53,9.3) 31.51,9.49 45.28,9.49 arc(46.25,9.3) 47.07,8.75 47.09,8.73 arc(47.47,8.17) 47.6,7.5 47.6,2.92 arc(47.79,1.95) 48.34,1.13 48.36,1.11 arc(49.06,0.64) 49.89,0.47 57.45,0.47 arc(57.62,0.51) 57.76,0.6 58.92,1.76 arc(59.47,2.59) 59.66,3.56 v2(59.66,4.02)
FAN2_PWM: length 44.4
  Top Layer w0.165: 94.28,8.98 v1(93.06,8.98) ; v1(55.22,2.13) 55.22,2.75 arc(55.21,2.79) U2.PL5
  Inner3 w0.165: v1(93.06,8.98) 82.94,8.98 arc(81.97,8.79) 81.14,8.24 81,8.09 arc(80.81,7.81) 80.75,7.48 80.75,6.82 arc(80.68,6.47) 80.48,6.17 75.52,1.22 arc(74.7,0.67) 73.72,0.47 57.92,0.47 arc(56.95,0.67) 56.13,1.22 v1(55.22,2.13)
FAN2_SPEED: length 44.2
  Top Layer w0.165: R60.2 98.14,7.42 arc(97.95,8.4) 97.4,9.22 97.26,9.36 arc(96.97,9.55) 96.64,9.62 v1(92.43,9.62) ; v1(60.3,4.67) 60.81,4.67 arc(60.88,4.65) U2.PH2
  Inner3 w0.165: v1(92.43,9.62) 88.16,9.62 arc(88,9.59) 87.86,9.49 arc(87.6,9.32) 87.29,9.26 82.71,9.26 arc(81.73,9.06) 80.91,8.51 80.75,8.35 arc(80.46,8.16) 80.13,8.09 75.64,8.09 arc(75.31,8.03) 75.03,7.84 arc(74.75,7.65) 74.42,7.59 73.08,7.59 arc(72.42,7.45) 71.86,7.08 71.8,7.02 arc(71.46,6.52) 71.35,5.94 71.35,4.95 arc(71.25,4.45) 70.97,4.03 arc(70.54,3.75) 70.05,3.65 66.3,3.65 arc(65.33,3.84) 64.51,4.39 64.24,4.67 arc(63.95,4.85) 63.62,4.92 60.91,4.92 arc(60.58,4.85) v1(60.3,4.67)
PCIE_RX_0N: length 114.6
  Top Layer w0.165: 59.83,36.35 59.83,36.19 60.03,35.99 60.19,35.99 60.36,35.99 60.55,35.8 60.55,35.63 60.55,35.47 60.75,35.27 60.91,35.27 ; J1.148 2.35,64.37 arc(2.04,64.31) v1(1.77,64.13) ; 59.83,36.35 59.83,36.52 59.64,36.71 59.48,36.71 ; 60.91,35.27 61.08,35.27 61.27,35.08 61.27,34.91 ; 61.27,34.91 61.27,34.75 61.47,34.55 61.63,34.55 ; 61.63,34.56 61.8,34.56 61.99,34.36 61.99,34.2 61.99,34.03 62.18,33.84 62.35,33.84 62.51,33.84 62.71,33.64 62.71,33.48 62.71,33.31 63.49,32.53 arc(64.04,31.7) 64.24,30.73 64.24,10.19 arc(64.4,9.34) 64.89,8.62 65.69,7.82 arc(66.31,7.4) 67.05,7.26 U2.SD8 ; 59.48,36.71 59.31,36.71 58.22,37.8 arc(57.74,38.52) 57.57,39.37 57.57,41.84 arc(57.61,42.07) v1(57.74,42.26)
  Bottom Layer w0.165: v1(1.77,64.13) 1.59,63.95 arc(1.46,63.87) 1.32,63.84 1.27,63.84 arc(1.24,63.83) 1.2,63.81 1.13,63.73 arc(1.12,63.72) 1.12,63.7 1.12,59.82 arc(1.29,58.96) 1.77,58.24 2.77,57.24 arc(3.24,56.54) 3.4,55.72 3.4,54.99 arc(3.57,54.14) 4.05,53.42 6.05,51.42 arc(6.77,50.94) 7.62,50.77 17.72,50.77 arc(18.57,50.94) 19.29,51.42 20.06,52.18 arc(20.88,52.73) 21.85,52.93 28.26,52.93 arc(29.23,52.73) 30.05,52.18 36.41,45.83 arc(37.13,45.35) 37.98,45.18 48.58,45.18 arc(49.55,44.99) 50.37,44.43 51.68,43.12 arc(52.08,42.86) 52.55,42.77 56.18,42.77 arc(56.35,42.8) 56.49,42.89 arc(56.63,42.99) 56.8,43.02 56.87,43.02 arc(57.1,42.97) 57.3,42.84 57.64,42.51 arc(57.71,42.39) v1(57.74,42.26)
PCIE_RX_0P: length 114.7
  Top Layer w0.165: J1.150 1.97,64.87 arc(1.61,64.8) v1(1.3,64.6) ; U2.SE8 67.27,6.66 arc(67.23,6.66) 67.19,6.67 ; 67.19,6.67 arc(67.32,6.66) 67.46,6.66 ; 67.19,6.67 arc(66.9,6.72) 66.62,6.8 arc(66.11,7.04) 65.66,7.4 64.66,8.4 arc(64.11,9.22) 63.92,10.19 63.92,30.73 arc(63.75,31.58) 63.27,32.3 57.99,37.58 arc(57.44,38.4) 57.25,39.37 57.25,41.84 arc(57.21,42.07) v1(57.08,42.26)
  Bottom Layer w0.165: v1(57.08,42.26) 52.97,42.26 arc(52,42.45) 51.17,43 50.06,44.12 arc(49.23,44.67) 48.26,44.86 37.98,44.86 arc(37.01,45.05) 36.18,45.61 29.83,51.96 arc(29.11,52.44) 28.26,52.61 21.85,52.61 arc(21,52.44) 20.28,51.96 19.52,51.19 arc(18.69,50.64) 17.72,50.45 7.62,50.45 arc(6.65,50.64) 5.83,51.19 3.83,53.19 arc(3.28,54.02) 3.08,54.99 3.08,55.72 arc(2.95,56.42) 2.55,57.01 1.54,58.02 arc(0.99,58.84) 0.8,59.82 0.8,63.7 arc(0.83,63.84) 0.9,63.96 0.92,63.98 arc(0.99,64.07) 1.01,64.18 arc(1.03,64.29) 1.09,64.39 v1(1.3,64.6)
PCIE_RX_1N: length 113.3
  Top Layer w0.165: U2.SA8 67.27,9.06 arc(67.18,9.04) 67.1,8.99 arc(67.02,8.93) 66.93,8.91 arc(66.38,9.02) 65.92,9.33 65.51,9.75 arc(65.32,10.03) 65.25,10.36 65.25,11.25 65.37,11.37 65.39,11.37 65.5,11.48 65.5,11.76 65.39,11.87 65.37,11.87 65.25,11.99 65.25,12.26 65.37,12.38 65.39,12.38 65.5,12.5 65.5,12.77 65.39,12.89 65.37,12.89 65.25,13.01 65.25,38.67 arc(65.06,39.64) 64.51,40.46 63.33,41.64 arc(62.5,42.19) 61.53,42.38 61.06,42.38 arc(60.87,42.51) 60.65,42.56 v1(60.47,42.56) ; J1.142 5.07,62.87 arc(5.13,62.89) 5.18,62.92 arc(5.23,62.95) 5.29,62.97 arc(5.5,63.01) 5.69,63.13 5.98,63.43 arc(6.21,63.47) 6.4,63.6 v1(6.52,63.72)
  Bottom Layer w0.165: v1(60.47,42.56) 60.17,42.56 arc(60.06,42.53) 59.97,42.47 59.94,42.44 arc(59.87,42.4) 59.8,42.38 59.76,42.38 arc(59.72,42.39) 59.68,42.42 59.66,42.44 arc(59.61,42.51) 59.6,42.58 59.6,43.17 arc(59.47,43.8) 59.12,44.33 58.88,44.56 arc(58.06,45.11) 57.09,45.31 54.84,45.31 arc(54.37,45.4) 53.97,45.66 53.19,46.45 arc(52.91,46.64) 52.57,46.7 38.87,46.7 arc(38.02,46.87) 37.3,47.35 30.94,53.71 arc(30.12,54.26) 29.15,54.45 21.09,54.45 arc(20.12,54.26) 19.3,53.71 18.4,52.81 arc(17.68,52.33) 16.83,52.16 8.77,52.16 arc(8.27,52.26) 7.85,52.54 5.59,54.8 arc(5.19,55.4) 5.05,56.1 5.05,61.58 arc(5.22,62.43) 5.7,63.15 5.9,63.34 arc(5.99,63.4) 6.1,63.43 arc(6.22,63.45) 6.31,63.51 v1(6.52,63.72)
PCIE_RX_1P: length 113.2
  Top Layer w0.165: v1(60.47,41.9) 60.65,41.9 arc(60.87,41.94) 61.06,42.07 61.53,42.07 arc(62.38,41.9) 63.1,41.42 64.28,40.24 arc(64.76,39.52) 64.93,38.67 64.93,10.36 arc(65.02,9.91) 65.28,9.52 65.69,9.11 arc(66.26,8.73) 66.93,8.6 arc(67.02,8.58) 67.1,8.53 arc(67.18,8.47) 67.27,8.46 U2.SB8 ; v1(6.05,64.19) 5.93,64.06 arc(5.8,63.87) 5.76,63.65 5.46,63.35 arc(5.38,63.3) 5.29,63.28 arc(5.23,63.3) 5.18,63.33 arc(5.13,63.36) 5.07,63.37 J1.144
  Bottom Layer w0.165: v1(60.47,41.9) 60.17,41.9 arc(60.06,41.92) 59.97,41.98 arc(59.87,42.04) 59.76,42.07 arc(59.6,42.1) 59.46,42.19 59.43,42.22 arc(59.32,42.39) 59.28,42.58 59.28,43.17 arc(59.18,43.67) 58.89,44.1 arc(58.12,44.62) 57.21,44.8 55.13,44.8 arc(54.16,44.99) 53.33,45.54 52.81,46.07 arc(52.45,46.3) 52.04,46.39 38.87,46.39 arc(37.9,46.58) 37.07,47.13 30.72,53.48 arc(30,53.96) 29.15,54.13 21.09,54.13 arc(20.24,53.96) 19.52,53.48 18.63,52.59 arc(17.81,52.04) 16.83,51.85 8.77,51.85 arc(8.15,51.97) 7.62,52.32 5.37,54.58 arc(4.9,55.27) 4.74,56.1 4.74,61.58 arc(4.93,62.55) 5.48,63.37 5.67,63.57 arc(5.74,63.66) 5.76,63.77 arc(5.78,63.88) 5.84,63.98 v1(6.05,64.19)
PCIE_RX_2N: length 142.6
  Top Layer w0.165: J1.136 5.07,61.37 arc(5.13,61.39) 5.18,61.42 arc(5.23,61.45) 5.29,61.47 5.99,61.47 arc(6.1,61.44) 6.2,61.38 arc(6.29,61.32) 6.41,61.29 v1(6.7,61.29) ; v1(15.14,71.3) 15.35,71.51 arc(15.41,71.6) 15.43,71.71 15.43,71.75 arc(15.45,71.83) 15.49,71.89 15.52,71.92 arc(15.55,71.94) 15.59,71.95 15.63,71.95 arc(16.14,71.85) 16.57,71.56 21.7,66.43 arc(22.53,65.88) 23.5,65.69 52.08,65.69 arc(53.05,65.88) 53.88,66.43 54.46,67.02 arc(54.98,67.36) 55.58,67.48 60.13,67.48 arc(60.98,67.32) 61.7,66.83 74.56,53.98 arc(74.62,53.88) 74.65,53.77 arc(74.67,53.66) 74.73,53.56 v1(75.96,52.34) ; U2.SD6 v2(70.46,7.26)
  Bottom Layer w0.165: v1(15.14,71.3) 14.93,71.09 arc(14.83,71.02) 14.72,71 arc(14.61,70.98) 14.51,70.92 8.55,64.95 arc(8.06,64.23) 7.89,63.38 7.89,61.98 arc(7.85,61.78) 7.74,61.62 7.72,61.59 arc(7.58,61.5) 7.42,61.47 arc(7.3,61.44) 7.21,61.38 arc(7.11,61.32) 7,61.29 v1(6.7,61.29) ; v1(75.96,52.34) 75.96,52.1 arc(76.02,51.76) 76.21,51.48 83.2,44.5 arc(83.75,43.67) 83.94,42.7 83.94,35.85 arc(83.75,34.88) 83.2,34.05 73.52,24.38 arc(73.04,23.66) 72.87,22.81 72.87,22.54 73,22.41 73,22.03 72.87,21.9 72.87,21.63 72.99,21.51 73.11,21.51 73.22,21.4 73.22,21.12 73.11,21 72.99,21 72.87,20.89 72.87,20.61 72.99,20.5 73.11,20.5 73.22,20.38 73.22,20.11 73.11,19.99 72.99,19.99 72.87,19.87 72.87,19.6 72.99,19.48 73.11,19.48 73.22,19.36 73.22,19.09 73.11,18.97 72.99,18.97 72.87,18.86 72.87,11.05 arc(72.68,10.08) 72.13,9.26 70.69,7.82 arc(70.52,7.56) v2(70.46,7.26)
PCIE_RX_2P: length 142.5
  Top Layer w0.165: v1(6.7,61.95) 6.41,61.95 arc(6.29,61.93) 6.2,61.87 arc(6.11,61.81) 5.99,61.78 5.29,61.78 arc(5.23,61.8) 5.18,61.83 arc(5.13,61.86) 5.07,61.87 J1.138 ; U2.SE6 v2(70.26,6.66) ; v1(14.67,71.76) 14.88,71.97 arc(14.98,72.04) 15.09,72.06 arc(15.2,72.08) 15.3,72.15 arc(15.43,72.24) 15.59,72.27 15.63,72.27 arc(16.26,72.14) 16.8,71.79 21.93,66.66 arc(22.65,66.18) 23.5,66.01 52.08,66.01 arc(52.93,66.18) 53.65,66.66 54.24,67.25 arc(54.86,67.66) 55.58,67.8 60.13,67.8 arc(61.1,67.61) 61.93,67.06 74.78,54.2 arc(74.88,54.14) 74.99,54.12 arc(75.1,54.09) 75.2,54.03 v1(75.41,53.82)
  Bottom Layer w0.165: v1(14.67,71.76) 14.46,71.55 arc(14.4,71.46) 14.37,71.35 arc(14.35,71.23) 14.29,71.14 8.32,65.17 arc(7.77,64.35) 7.58,63.38 7.58,61.98 arc(7.56,61.91) 7.52,61.84 7.49,61.81 arc(7.46,61.79) 7.42,61.78 7.38,61.78 arc(7.3,61.8) 7.24,61.84 7.21,61.87 arc(7.11,61.93) 7,61.95 v1(6.7,61.95) ; v2(70.26,6.66) 70.16,6.76 arc(70.1,6.85) 70.08,6.95 70.08,7.19 arc(70.07,7.26) 70.08,7.32 70.08,7.35 arc(70.14,7.69) 70.33,7.97 72.18,9.81 arc(72.45,10.39) 72.55,11.02 72.55,13.17 72.55,22.81 arc(72.75,23.78) 73.3,24.6 82.97,34.28 arc(83.45,35) 83.62,35.85 83.62,42.7 arc(83.45,43.55) 82.97,44.27 75.79,51.46 arc(75.42,52.01) 75.28,52.67 75.28,53.52 arc(75.32,53.68) v1(75.41,53.82)
PCIE_RX_3N: length 107.2
  Top Layer w0.165: J1.120 5.07,57.37 arc(5.13,57.39) 5.18,57.42 arc(5.23,57.45) 5.29,57.47 arc(5.5,57.51) 5.69,57.63 5.92,57.86 6.08,57.86 6.15,57.79 6.32,57.79 6.51,57.98 6.51,58.15 6.44,58.22 6.44,58.39 7.25,59.2 arc(7.97,59.68) 8.82,59.85 14.5,59.85 arc(14.75,59.8) 14.96,59.66 arc(15.1,59.56) 15.27,59.53 23.87,59.53 arc(24.2,59.6) 24.48,59.78 24.6,59.9 arc(24.92,60.11) 25.3,60.19 29.79,60.19 arc(30.15,60.11) v1(30.45,59.91) ; U2.SA6 arc(70.97,9.07) 70.97,9.1 70.97,10.9 arc(70.96,10.92) 70.95,10.94 arc(70.94,10.96) 70.93,10.98 70.93,34.89 arc(70.74,35.86) 70.19,36.68 59.65,47.23 arc(58.82,47.78) 57.85,47.97 53.09,47.97 arc(52.59,47.87) v1(52.17,47.59)
  Bottom Layer w0.165: v1(52.17,47.59) 52.48,47.9 arc(52.74,48.3) 52.84,48.76 arc(52.74,49.23) 52.48,49.63 50.28,51.83 arc(49.56,52.31) 48.71,52.48 38.61,52.48 arc(37.64,52.67) 36.82,53.23 30.68,59.36 arc(30.51,59.61) v1(30.45,59.91)
PCIE_RX_3P: length 107.2
  Top Layer w0.165: 25.63,60.5 25.3,60.5 arc(24.8,60.4) 24.37,60.12 24.26,60.01 arc(24.08,59.89) 23.87,59.85 15.27,59.85 arc(15.22,59.86) 15.18,59.88 arc(14.92,60.07) 14.61,60.16 14.6,60.16 8.82,60.16 arc(7.85,59.97) 7.03,59.42 5.46,57.85 arc(5.38,57.8) 5.29,57.78 arc(5.23,57.8) 5.18,57.83 arc(5.13,57.86) 5.07,57.87 J1.122 ; 25.63,60.5 30.73,60.5 arc(31.33,60.38) v1(31.85,60.04) ; 25.63,60.5 arc(25.63,60.5) 25.63,60.5 ; v1(53.82,47.21) 54.08,47.46 arc(54.29,47.61) 54.54,47.66 57.85,47.66 arc(58.7,47.49) 59.42,47 69.97,36.46 arc(70.45,35.74) 70.62,34.89 70.62,10.22 arc(70.61,10.2) 70.6,10.18 arc(70.59,10.16) 70.59,10.14 70.59,10 arc(70.45,9.79) 70.4,9.55 70.4,8.86 arc(70.47,8.69) 70.63,8.62 70.73,8.62 arc(70.81,8.6) 70.88,8.56 U2.SB6
  Bottom Layer w0.165: v1(31.85,60.04) 31.85,59.35 arc(31.98,58.69) 32.35,58.14 37.04,53.45 arc(37.76,52.97) 38.61,52.8 48.71,52.8 arc(49.68,52.61) 50.5,52.05 52.7,49.85 arc(53.04,49.35) 53.15,48.76 53.15,48.64 arc(53.29,47.94) 53.69,47.34 v1(53.82,47.21)
PCIE_RX_4N: length 116.5
  Top Layer w0.165: J1.114 1.61,55.87 arc(1.57,55.87) v1(1.54,55.85) ; v1(25.69,49.81) 25.9,49.6 arc(25.96,49.5) 25.98,49.39 arc(26,49.28) 26.07,49.18 27.08,48.17 arc(27.58,47.84) 28.17,47.72 28.95,47.72 arc(29.28,47.78) 29.56,47.97 29.84,48.24 arc(30.66,48.8) 31.63,48.99 58.61,48.99 arc(59.58,48.8) 60.41,48.24 78.86,29.79 arc(79.41,28.97) 79.6,28 79.6,19.86 arc(79.47,19.2) 79.09,18.64 76.11,15.65 arc(75.63,14.93) 75.46,14.08 75.46,10.49 arc(75.5,10.3) 75.61,10.13 arc(75.7,10) 75.73,9.84 75.73,8.86 arc(75.66,8.69) 75.49,8.62 75.4,8.62 arc(75.32,8.6) 75.24,8.56 U2.SB3
  Bottom Layer w0.165: v1(1.54,55.85) 1.54,55.55 arc(1.52,55.44) 1.46,55.34 arc(1.39,55.25) 1.37,55.14 1.37,55.11 arc(1.54,54.26) 2.02,53.54 5.39,50.18 arc(6.21,49.63) 7.18,49.43 22.93,49.43 arc(23.02,49.45) 23.09,49.5 23.33,49.74 arc(23.97,50.16) 24.72,50.31 24.76,50.31 arc(24.92,50.28) 25.06,50.19 arc(25.16,50.13) 25.27,50.1 arc(25.38,50.08) 25.47,50.02 v1(25.69,49.81)
PCIE_RX_4P: length 116.5
  Top Layer w0.165: v1(25.22,49.34) 25.43,49.13 arc(25.52,49.07) 25.64,49.05 arc(25.75,49.02) 25.84,48.96 26.86,47.94 arc(27.46,47.54) 28.17,47.4 28.95,47.4 arc(29.4,47.49) 29.79,47.75 30.06,48.02 arc(30.78,48.5) 31.63,48.67 58.61,48.67 arc(59.46,48.5) 60.18,48.02 78.63,29.57 arc(79.12,28.85) 79.29,28 79.29,19.86 arc(79.18,19.32) 78.87,18.86 75.89,15.88 arc(75.34,15.05) 75.14,14.08 75.14,12.41 U2.SA3 ; v1(0.88,55.85) 0.88,55.97 arc(0.91,56.11) 0.99,56.23 arc(1.15,56.34) 1.34,56.37 J1.116
  Bottom Layer w0.165: v1(25.22,49.34) 25.01,49.55 arc(24.94,49.65) 24.92,49.76 24.92,49.8 arc(24.91,49.87) 24.86,49.94 24.84,49.97 arc(24.8,49.99) 24.76,50 24.72,50 arc(24.09,49.87) 23.55,49.51 23.31,49.27 arc(23.14,49.16) 22.93,49.12 7.05,49.12 arc(6.08,49.31) 5.25,49.86 1.8,53.32 arc(1.25,54.14) 1.05,55.11 1.05,55.14 arc(1.03,55.25) 0.97,55.34 arc(0.9,55.44) 0.88,55.55 v1(0.88,55.85)
PCIE_RX_5N: length 144.5
  Top Layer w0.165: J1.108 5.07,54.37 arc(5.13,54.39) 5.18,54.42 arc(5.23,54.45) 5.29,54.47 5.36,54.47 arc(6.33,54.66) 7.15,55.21 7.75,55.81 arc(8.15,56.41) 8.29,57.12 arc(8.43,57.82) 8.83,58.41 8.96,58.54 arc(9.42,58.85) 9.96,58.96 14.07,58.96 arc(14.32,58.91) 14.53,58.77 14.53,58.76 arc(14.7,58.65) 14.89,58.62 23.81,58.62 arc(24.5,58.75) 25.09,59.15 arc(25.29,59.28) 25.52,59.33 27.15,59.33 arc(27.64,59.23) 28.05,58.96 arc(28.46,58.68) 28.94,58.58 40.65,58.58 arc(41.62,58.78) 42.44,59.33 42.76,59.64 arc(42.96,59.94) v1(43.03,60.29) ; v2(75.92,6.7) 75.24,6.7 arc(75.19,6.69) U2.SE3
  Bottom Layer w0.165: v2(75.92,6.7) 76.17,6.7 arc(76.29,6.72) 76.39,6.79 76.43,6.82 arc(76.52,6.97) 76.55,7.13 76.55,7.21 arc(76.48,7.56) 76.29,7.86 74.89,9.26 arc(74.33,10.08) 74.14,11.05 74.14,12.68 arc(74.14,12.7) 74.13,12.72 arc(74.11,12.74) 74.11,12.76 74.11,17.68 arc(74.28,18.53) 74.76,19.25 84.59,29.08 arc(85.14,29.9) 85.33,30.87 85.33,45.1 arc(85.14,46.08) 84.59,46.9 62.36,69.12 arc(61.54,69.67) 60.57,69.87 58.42,69.87 arc(57.45,69.67) 56.63,69.12 48.1,60.6 arc(47.76,60.37) 47.37,60.29 v1(43.03,60.29)
PCIE_RX_5P: length 144.5
  Top Layer w0.165: J1.110 5.07,54.87 arc(5.13,54.86) 5.18,54.83 arc(5.23,54.8) 5.29,54.78 5.36,54.78 arc(6.21,54.95) 6.93,55.43 7.53,56.03 arc(7.86,56.53) 7.97,57.12 arc(8.14,57.94) 8.6,58.63 8.74,58.77 arc(9.3,59.14) 9.96,59.28 14.16,59.28 arc(14.46,59.22) 14.71,59.05 14.81,58.95 arc(14.85,58.94) 14.89,58.93 23.81,58.93 arc(24.38,59.05) 24.87,59.37 arc(25.17,59.57) 25.52,59.64 27.15,59.64 arc(27.76,59.52) 28.27,59.18 arc(28.47,59.03) 28.7,58.93 40.13,58.93 arc(40.96,59.1) v1(41.66,59.57) ; v2(75.92,7.21) 75.26,7.21 arc(75.2,7.22) U2.SD3
  Bottom Layer w0.165: v2(75.92,7.21) 74.5,8.62 arc(73.95,9.44) 73.76,10.42 73.76,12.68 arc(73.76,12.7) 73.78,12.72 arc(73.79,12.74) 73.79,12.76 73.79,17.68 arc(73.99,18.65) 74.54,19.48 74.81,19.75 74.81,19.92 74.18,20.55 74.18,20.72 74.37,20.91 74.54,20.91 75.17,20.28 75.34,20.28 84.36,29.3 arc(84.84,30.02) 85.01,30.87 85.01,45.1 arc(84.84,45.95) 84.36,46.68 62.14,68.9 arc(61.42,69.38) 60.57,69.55 58.42,69.55 arc(57.57,69.38) 56.85,68.9 48.27,60.31 arc(47.44,59.76) 46.47,59.57 v1(41.66,59.57)
PCIE_RX_6N: length 118
  Top Layer w0.165: U2.SB1 78.86,8.46 arc(78.95,8.47) 79.03,8.53 arc(79.11,8.58) 79.2,8.6 79.28,8.6 arc(79.99,8.74) 80.59,9.14 arc(80.94,9.67) 81.06,10.28 81.06,28.82 arc(80.87,29.8) 80.32,30.62 61.17,49.77 arc(60.35,50.32) 59.37,50.51 30.72,50.51 arc(29.89,50.35) 29.18,49.88 29.14,49.84 arc(28.82,49.62) v1(28.45,49.55) ; v1(1.67,52.04) 1.76,52.13 arc(2.59,52.68) 3.56,52.87 J1.102
  Bottom Layer w0.165: v1(1.67,52.04) 1.67,51.74 arc(1.65,51.63) 1.58,51.53 arc(1.52,51.44) 1.5,51.33 1.5,50.69 arc(1.53,50.53) 1.62,50.39 1.95,50.06 2.11,50.06 2.38,50.33 2.55,50.33 2.74,50.14 2.74,49.97 2.47,49.7 2.47,49.54 3.26,48.75 arc(3.98,48.27) 4.83,48.1 26.77,48.1 arc(27.2,48.19) 27.57,48.43 28.06,48.92 arc(28.13,49.02) 28.15,49.13 arc(28.17,49.24) 28.23,49.34 v1(28.45,49.55)
PCIE_RX_6P: length 118
  Top Layer w0.165: 29.18,49.41 29.56,49.79 arc(30.1,50.09) 30.72,50.2 59.37,50.2 arc(60.22,50.03) 60.95,49.54 80.09,30.39 arc(80.58,29.67) 80.75,28.82 80.75,10.28 arc(80.65,9.79) 80.36,9.36 arc(79.87,9.03) 79.28,8.91 79.2,8.91 arc(79.11,8.93) 79.03,8.99 arc(78.95,9.04) 78.86,9.06 U2.SA1 ; 29.18,49.41 28.96,49.18 arc(28.92,49.14) v1(28.91,49.08) 29.08,49.25 arc(29.14,49.32) 29.18,49.41 ; J1.104 2.35,53.37 arc(2.09,53.32) 1.88,53.18 1.2,52.5 arc(1.06,52.29) v1(1.01,52.04)
  Bottom Layer w0.165: v1(28.91,49.08) 28.7,48.87 arc(28.61,48.81) 28.5,48.78 arc(28.38,48.76) 28.29,48.7 27.8,48.21 arc(27.33,47.89) 26.77,47.78 4.83,47.78 arc(3.86,47.98) 3.03,48.53 1.4,50.16 arc(1.24,50.4) 1.18,50.69 1.18,51.33 arc(1.16,51.44) 1.09,51.53 arc(1.03,51.63) 1.01,51.74 v1(1.01,52.04)
PCIE_RX_7N: length 164.7
  Top Layer w0.165: v1(9.44,53.32) 8.18,52.06 arc(7.42,51.55) 6.52,51.37 J1.96 ; U2.SD1 v1(79.22,7.26)
  Bottom Layer w0.165: v1(79.22,7.26) 79.22,7.52 arc(79.25,7.66) 79.33,7.79 arc(79.41,7.91) 79.44,8.05 79.44,8.18 arc(79.48,8.38) 79.59,8.55 80.24,9.19 arc(81.06,9.74) 82.03,9.94 83.25,9.94 arc(84.1,10.11) 84.82,10.59 84.85,10.61 arc(85.64,11.15) 86.59,11.33 88.2,11.33 arc(89.05,11.5) 89.77,11.98 90.07,12.28 90.07,12.45 89.95,12.57 89.95,12.73 90.15,12.93 90.31,12.93 90.43,12.81 90.6,12.81 90.79,13 90.79,13.17 90.67,13.28 90.67,13.45 90.87,13.64 91.03,13.64 91.15,13.53 91.32,13.53 91.84,14.05 arc(92.32,14.77) 92.49,15.62 92.49,46.29 arc(92.32,47.14) 91.84,47.86 67.17,72.53 arc(66.45,73.01) 65.6,73.18 19.69,73.18 arc(18.84,73.01) 18.12,72.53 10.09,64.49 arc(9.6,63.77) 9.44,62.92 9.44,53.32 arc(9.44,53.32) v1(9.44,53.32)
PCIE_RX_7P: length 164.7
  Top Layer w0.165: J1.98 6.14,51.87 arc(7.11,52.07) 7.93,52.62 v1(8.72,53.4) ; U2.SE1 79.19,6.66 arc(79.42,6.7) 79.6,6.82 79.68,6.9 arc(79.87,7.16) v1(79.98,7.46)
  Bottom Layer w0.165: v1(79.98,7.46) 79.98,7.72 arc(79.95,7.87) 79.87,7.99 79.82,8.04 arc(79.78,8.11) 79.76,8.18 arc(79.78,8.26) 79.82,8.32 80.46,8.97 arc(81.18,9.45) 82.03,9.62 83.25,9.62 arc(84.22,9.81) 85.05,10.36 85.07,10.39 arc(85.77,10.85) 86.59,11.02 88.2,11.02 arc(89.17,11.21) 90,11.76 92.07,13.83 arc(92.62,14.65) 92.81,15.62 92.81,46.29 arc(92.62,47.26) 92.07,48.08 67.39,72.76 arc(66.57,73.31) 65.6,73.5 19.69,73.5 arc(18.72,73.31) 17.9,72.76 9.86,64.72 arc(9.31,63.89) 9.12,62.92 9.12,54.37 arc(9.01,53.85) v1(8.72,53.4)
PCIE_TX_0N: length 104.4
  Top Layer w0.165: U2.SG8 67.27,5.46 arc(67.18,5.44) 67.1,5.38 arc(67.02,5.33) 66.93,5.31 arc(66.42,5.41) 65.99,5.7 63.87,7.82 arc(63.39,8.55) 63.22,9.4 63.22,29.72 arc(63.03,30.69) 62.48,31.51 56.09,37.89 arc(55.61,38.62) 55.44,39.47 55.44,46.04 arc(55.47,46.15) 55.53,46.24 arc(55.59,46.34) 55.61,46.45 v1(55.61,46.75) ; C2.2 18.52,63.72 arc(18.83,63.78) 19.1,63.96 arc(19.36,64.13) 19.67,64.2 19.94,64.2 20.14,64 20.45,64 20.65,64.2 20.96,64.2 21.15,64 21.47,64 21.66,64.2 21.97,64.2 22.17,64 22.48,64 22.68,64.2 54.38,64.2 arc(54.95,64.31) 55.44,64.64 55.47,64.67 arc(55.57,64.73) 55.68,64.76 arc(55.79,64.78) 55.89,64.84 v1(56.1,65.05)
  Bottom Layer w0.165: v1(56.1,65.05) 55.89,64.84 arc(55.79,64.78) 55.68,64.76 55.64,64.76 arc(55.57,64.74) 55.5,64.7 55.47,64.67 arc(55.45,64.64) 55.44,64.59 55.44,47.34 arc(55.57,47.15) 55.61,46.92 v1(55.61,46.75)
PCIE_TX_0P: length 104.4
  Top Layer w0.165: U2.SH8 67.27,4.86 arc(67.18,4.87) 67.1,4.93 arc(67.02,4.98) 66.93,5 arc(66.3,5.12) 65.77,5.48 63.65,7.6 arc(63.1,8.42) 62.9,9.4 62.9,29.72 arc(62.73,30.57) 62.25,31.29 55.87,37.67 arc(55.32,38.49) 55.13,39.47 55.13,46.04 arc(55.1,46.15) 55.04,46.24 arc(54.98,46.34) 54.95,46.45 v1(54.95,46.75) ; v1(55.63,65.52) 55.42,65.31 arc(55.36,65.21) 55.33,65.1 arc(55.31,64.99) 55.25,64.89 55.22,64.86 arc(54.83,64.61) 54.38,64.51 19.67,64.51 arc(19.36,64.58) 19.1,64.75 arc(18.83,64.93) 18.52,64.99 C1.2
  Bottom Layer w0.165: v1(54.95,46.75) 54.95,46.92 arc(55,47.15) 55.13,47.34 55.13,64.59 arc(55.16,64.76) 55.25,64.89 arc(55.31,64.99) 55.33,65.1 arc(55.36,65.21) 55.42,65.31 v1(55.63,65.52)
PCIE_TX_1N: length 129.5
  Top Layer w0.165: v1(81.78,42.26) 81.78,42.96 arc(81.59,43.94) 81.04,44.76 63.77,62.02 arc(63.05,62.5) 62.2,62.67 47.28,62.67 47.16,62.56 47.16,62.45 47.04,62.34 46.77,62.34 46.65,62.45 46.65,62.56 46.54,62.67 46.26,62.67 46.14,62.56 46.14,62.45 46.03,62.34 45.75,62.34 45.64,62.45 45.64,62.56 45.52,62.67 45.24,62.67 45.13,62.56 45.13,62.45 45.01,62.34 44.74,62.34 44.62,62.45 44.62,62.56 44.5,62.67 44.23,62.67 44.11,62.56 44.11,62.45 44,62.34 43.72,62.34 43.6,62.45 43.6,62.56 43.49,62.67 43.21,62.67 43.1,62.56 43.1,62.45 42.98,62.34 42.7,62.34 42.59,62.45 42.59,62.56 42.47,62.67 42.2,62.67 42.08,62.56 42.08,62.45 41.96,62.34 41.69,62.34 41.57,62.45 41.57,62.56 41.46,62.67 41.18,62.67 41.06,62.56 41.06,62.45 40.95,62.34 40.67,62.34 40.56,62.45 40.56,62.56 40.44,62.67 40.17,62.67 40.05,62.56 40.05,62.45 39.93,62.34 39.66,62.34 39.54,62.45 39.54,62.56 39.42,62.67 39.15,62.67 39.03,62.56 39.03,62.45 38.92,62.34 38.64,62.34 38.52,62.45 38.52,62.56 38.41,62.67 38.13,62.67 38.02,62.56 38.02,62.45 37.9,62.34 37.62,62.34 37.51,62.45 37.51,62.56 37.39,62.67 37.12,62.67 37,62.56 37,62.45 36.88,62.34 36.61,62.34 36.49,62.45 36.49,62.56 36.38,62.67 36.1,62.67 35.98,62.56 35.98,62.45 35.87,62.34 35.59,62.34 35.48,62.45 35.48,62.56 35.36,62.67 35.08,62.67 34.97,62.56 34.97,62.45 34.85,62.34 34.58,62.34 34.46,62.45 34.46,62.56 34.34,62.67 34.07,62.67 33.95,62.56 33.95,62.45 33.84,62.34 33.56,62.34 33.44,62.45 33.44,62.56 33.33,62.67 33.05,62.67 32.94,62.56 32.94,62.45 32.82,62.34 32.55,62.34 32.43,62.45 32.43,62.56 32.31,62.67 32.04,62.67 31.92,62.56 31.92,62.45 31.8,62.34 31.53,62.34 31.41,62.45 31.41,62.56 31.3,62.67 31.02,62.67 30.9,62.56 30.9,62.45 30.79,62.34 30.51,62.34 30.4,62.45 30.4,62.56 30.28,62.67 30,62.67 29.89,62.56 29.89,62.45 29.77,62.34 29.5,62.34 29.38,62.45 29.38,62.56 29.26,62.67 28.31,62.67 arc(28,62.61) 27.73,62.43 arc(27.47,62.26) 27.16,62.2 C4.2 ; U2.SK8 67.27,3.66 arc(67.18,3.64) 67.1,3.59 arc(67.02,3.53) 66.93,3.51 arc(66.75,3.48) 66.59,3.38 66.58,3.36 arc(66.47,3.2) 66.43,3 66.43,2.84 arc(66.41,2.72) 66.34,2.63 arc(66.28,2.54) 66.26,2.42 v1(66.26,2.13)
  Bottom Layer w0.165: v1(66.26,2.13) 66.26,2.42 arc(66.28,2.54) 66.34,2.63 arc(66.41,2.72) 66.43,2.84 66.43,7.27 arc(66.62,8.24) 67.17,9.07 67.97,9.86 arc(68.45,10.58) 68.62,11.43 68.62,18.35 arc(68.45,19.2) 67.97,19.92 66.68,21.21 arc(66.52,21.45) 66.46,21.74 66.46,34.86 arc(66.65,35.83) 67.2,36.66 75.04,44.5 arc(75.87,45.05) 76.84,45.24 78.17,45.24 arc(79.08,45.06) 79.86,44.54 81.52,42.88 arc(81.71,42.59) v1(81.78,42.26)
PCIE_TX_1P: length 129.8
  Top Layer w0.165: v1(66.92,2.13) 66.92,2.42 arc(66.89,2.54) 66.83,2.63 arc(66.77,2.73) 66.75,2.84 66.75,3 arc(66.76,3.07) 66.8,3.14 66.82,3.15 arc(66.87,3.18) 66.93,3.2 66.94,3.2 arc(67.02,3.18) 67.09,3.14 67.1,3.13 arc(67.18,3.07) 67.27,3.06 U2.SL8 ; v1(82.57,38.32) 82.57,40.27 arc(82.55,40.38) 82.48,40.48 arc(82.42,40.57) 82.4,40.68 82.4,42.8 arc(82.2,43.77) 81.65,44.59 64,62.25 arc(63.18,62.8) 62.2,62.99 27.1,62.99 26.93,63.16 C3.2
  Bottom Layer w0.165: v1(66.92,2.13) 66.92,2.42 arc(66.89,2.54) 66.83,2.63 arc(66.77,2.72) 66.75,2.84 66.75,7.27 arc(66.91,8.12) 67.4,8.84 68.19,9.64 arc(68.74,10.46) 68.93,11.43 68.93,18.35 arc(68.74,19.32) 68.19,20.14 66.9,21.43 arc(66.81,21.57) 66.78,21.74 66.78,34.86 arc(66.94,35.71) 67.43,36.43 75.27,44.27 arc(75.99,44.76) 76.84,44.92 77.79,44.92 arc(78.76,44.73) 79.58,44.18 80.64,43.13 arc(81.19,42.3) 81.38,41.33 81.38,40.56 arc(81.57,39.59) 82.12,38.76 v1(82.57,38.32)
PCIE_TX_2N: length 108.6
  Top Layer w0.165: v2(70.45,4.85) 70.98,4.85 U2.SH6 ; C6.2 23.35,60.67 arc(23.66,60.73) 23.92,60.91 arc(24.19,61.09) 24.5,61.15 61.95,61.15 arc(62.8,60.98) 63.52,60.5 80.11,43.91 arc(80.2,43.77) 80.24,43.6 80.24,41.7 arc(80.19,41.48) v1(80.07,41.29)
  Bottom Layer w0.165: v2(70.45,4.85) 70.2,4.85 arc(70.03,4.89) 69.89,4.99 69.75,5.12 arc(69.62,5.32) 69.57,5.55 69.57,5.91 arc(69.43,6.35) 69.38,6.81 69.38,7.38 arc(69.49,8.03) 69.8,8.62 arc(69.93,8.81) 70.08,8.98 70.73,9.64 arc(71.28,10.46) 71.47,11.43 71.47,13.32 arc(71.48,13.34) 71.49,13.36 arc(71.5,13.37) 71.51,13.39 71.51,29.75 arc(71.7,30.72) 72.25,31.54 79.59,38.88 arc(80.07,39.6) 80.24,40.45 80.24,40.57 arc(80.22,40.69) 80.15,40.78 arc(80.09,40.88) 80.07,40.99 v1(80.07,41.29)
PCIE_TX_2P: length 108.6
  Top Layer w0.165: U2.SG6 v2(70.26,5.46) ; C5.2 23.35,61.94 arc(23.66,61.88) 23.92,61.7 arc(24.19,61.53) 24.5,61.47 61.95,61.47 arc(62.92,61.27) 63.75,60.72 80.33,44.13 arc(80.5,43.89) 80.55,43.6 80.55,41.7 arc(80.6,41.48) v1(80.73,41.29)
  Bottom Layer w0.165: v1(80.73,41.29) 80.73,40.99 arc(80.7,40.88) 80.64,40.78 arc(80.58,40.69) 80.55,40.57 80.55,40.45 arc(80.36,39.48) 79.81,38.66 72.47,31.32 arc(71.99,30.6) 71.82,29.75 71.82,28.78 71.94,28.67 72.02,28.67 72.14,28.55 72.14,28.27 72.02,28.16 71.94,28.16 71.82,28.04 71.82,13.39 arc(71.83,13.37) 71.84,13.36 arc(71.85,13.34) 71.86,13.32 71.86,11.31 arc(71.66,10.33) 71.11,9.51 70.2,8.6 arc(69.83,8.04) 69.7,7.38 69.7,6.81 arc(69.84,6.08) v2(70.26,5.46)
PCIE_TX_3N: length 105.9
  Top Layer w0.165: U2.SK6 70.88,3.56 arc(70.81,3.51) 70.73,3.49 70.63,3.49 arc(70.47,3.42) 70.4,3.26 v2(70.4,2.51) ; v1(78.61,42.72) 77.62,43.71 arc(77.54,43.76) 77.44,43.78 arc(77.03,43.86) 76.68,44.1 63.71,57.07 arc(62.99,57.55) 62.14,57.72 28.31,57.72 arc(28,57.66) 27.73,57.48 arc(27.47,57.31) 27.16,57.24 C8.2
  Bottom Layer w0.165: v2(70.4,2.51) 70.4,2.74 arc(70.42,2.82) 70.46,2.89 arc(70.51,2.96) 70.52,3.04 70.52,3.16 arc(70.51,3.24) 70.47,3.3 70.47,3.3 arc(70.4,3.34) 70.32,3.36 68.98,3.36 arc(68.56,3.44) 68.2,3.68 arc(67.95,4.06) 67.86,4.52 67.86,7.5 arc(68.01,8.29) 68.46,8.95 69.36,9.86 arc(69.84,10.58) 70.01,11.43 70.01,30.16 arc(70.21,31.13) 70.76,31.96 78.13,39.33 arc(78.61,40.05) 78.78,40.9 78.78,42.01 arc(78.75,42.12) 78.69,42.22 arc(78.63,42.31) 78.61,42.42 v1(78.61,42.72)
PCIE_TX_3P: length 105.9
  Top Layer w0.165: C7.2 27.16,58.51 arc(27.47,58.45) 27.73,58.28 arc(28,58.1) 28.31,58.04 62.14,58.04 arc(63.11,57.84) 63.93,57.29 76.63,44.59 arc(77.11,44.27) 77.67,44.16 77.7,44.16 arc(78.05,44.09) 78.35,43.89 79.09,43.16 arc(79.22,42.96) v1(79.27,42.72) ; v2(70.97,2.63) 70.97,3.01 arc(70.97,3.04) U2.SL6
  Bottom Layer w0.165: 68.17,7.53 68.17,7.5 ; 68.17,7.5 68.17,7.15 68.29,7.03 68.36,7.03 68.48,6.92 68.48,6.64 68.36,6.52 68.29,6.52 68.17,6.41 68.17,4.52 arc(68.24,4.18) 68.43,3.9 arc(68.68,3.73) 68.98,3.68 70.32,3.68 arc(70.52,3.64) 70.69,3.52 70.69,3.52 arc(70.8,3.36) 70.84,3.16 arc(70.86,3.08) 70.9,3.01 arc(70.95,2.94) 70.97,2.86 v2(70.97,2.63) ; 68.17,7.5 arc(68.3,8.17) 68.68,8.73 69.59,9.64 arc(70.14,10.46) 70.33,11.43 70.33,30.16 arc(70.5,31.01) 70.98,31.73 78.35,39.1 arc(78.9,39.92) 79.09,40.9 79.09,42.01 arc(79.12,42.12) 79.18,42.22 arc(79.24,42.31) 79.27,42.42 v1(79.27,42.72)
